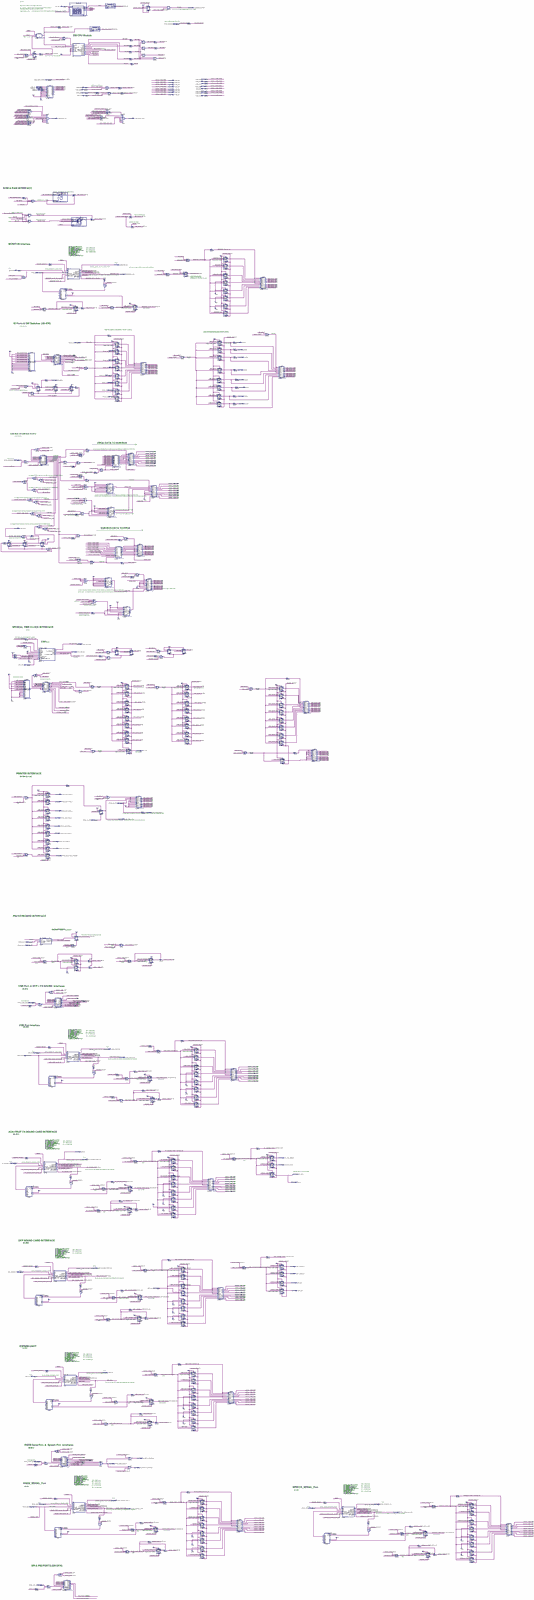
[diagram p0: schematic sheet, whole]
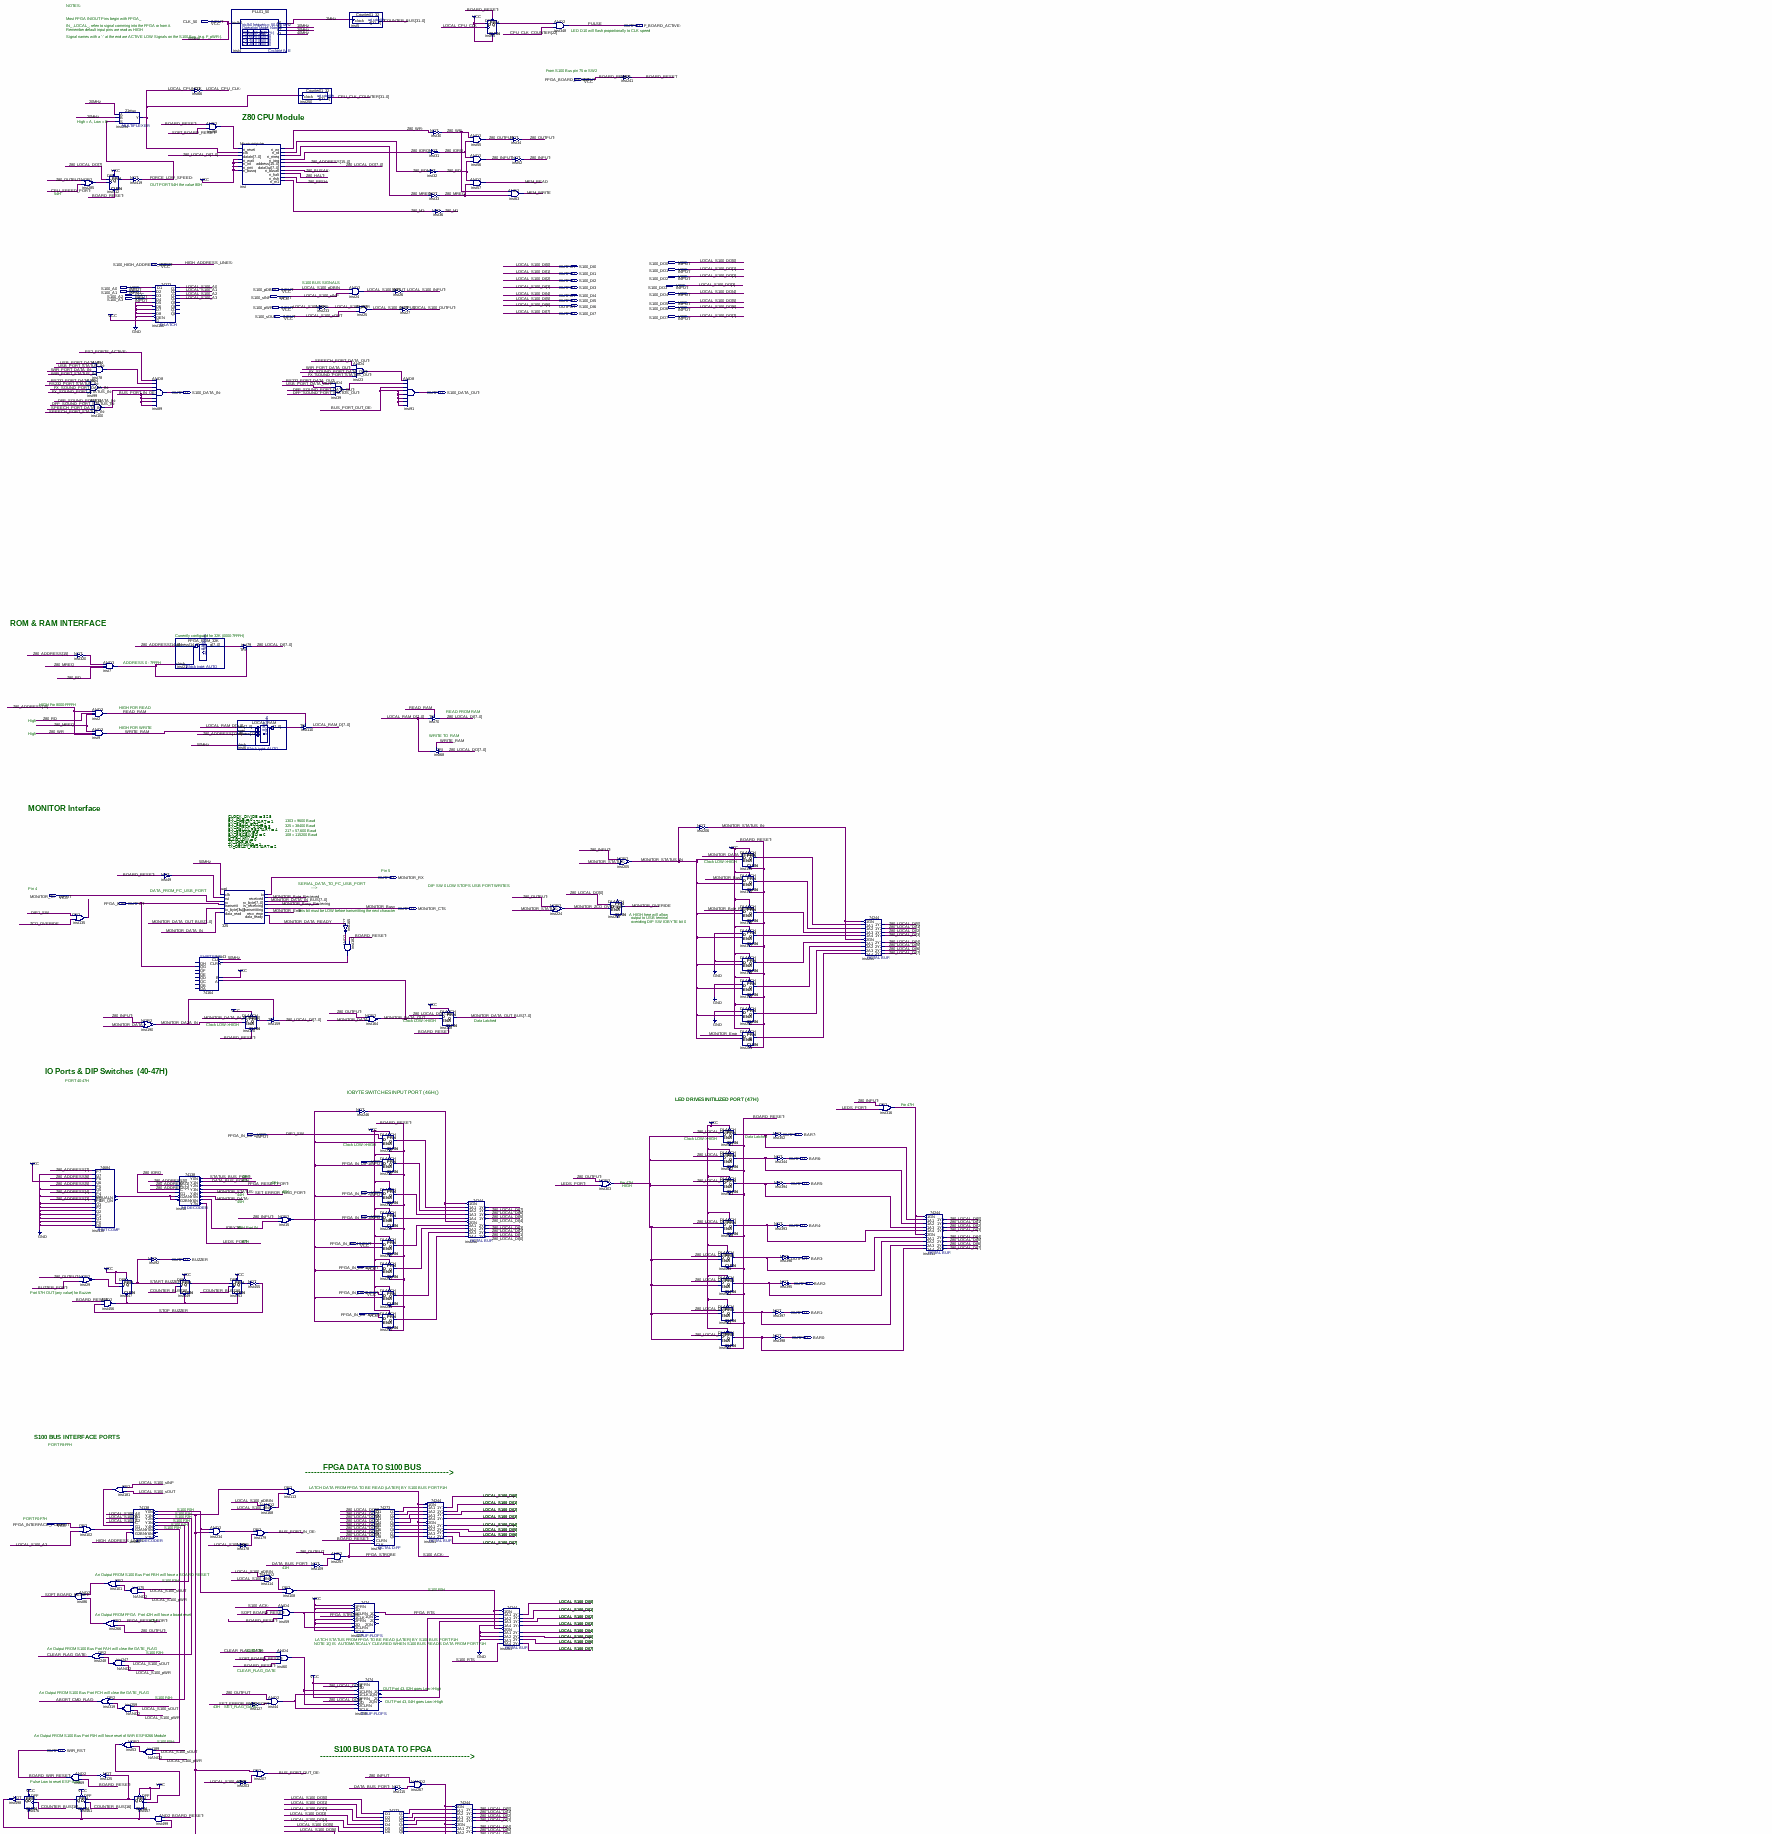
[diagram p1: schematic sheet, upper part]
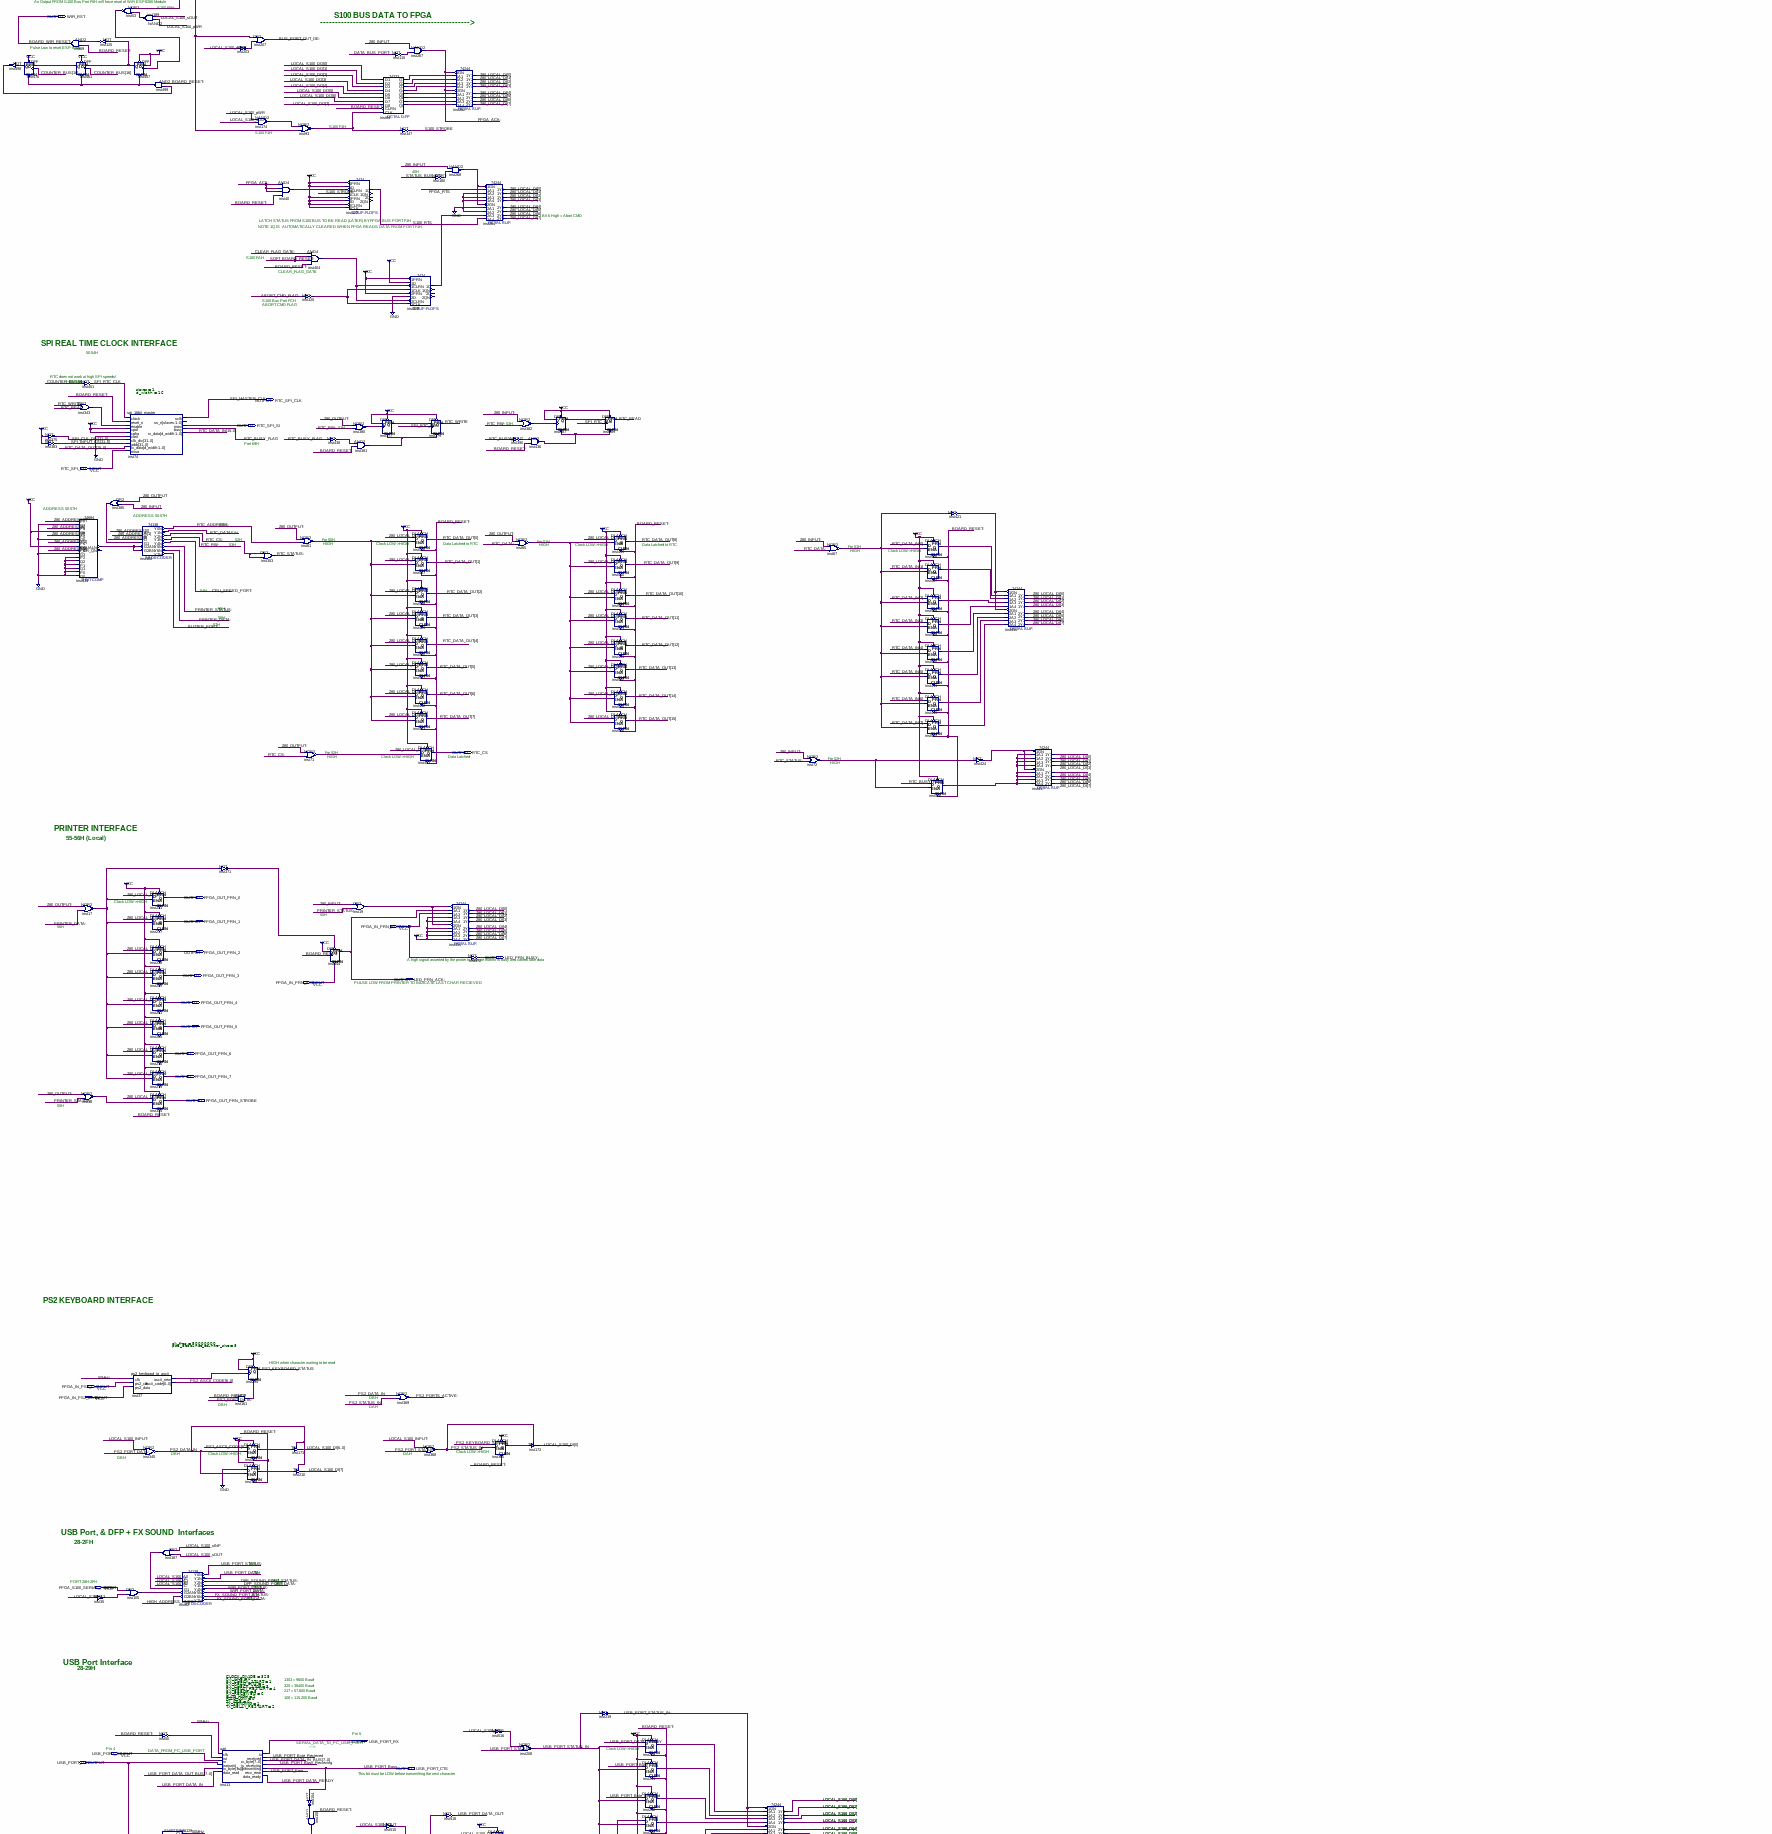
[diagram p2: schematic sheet, middle part]
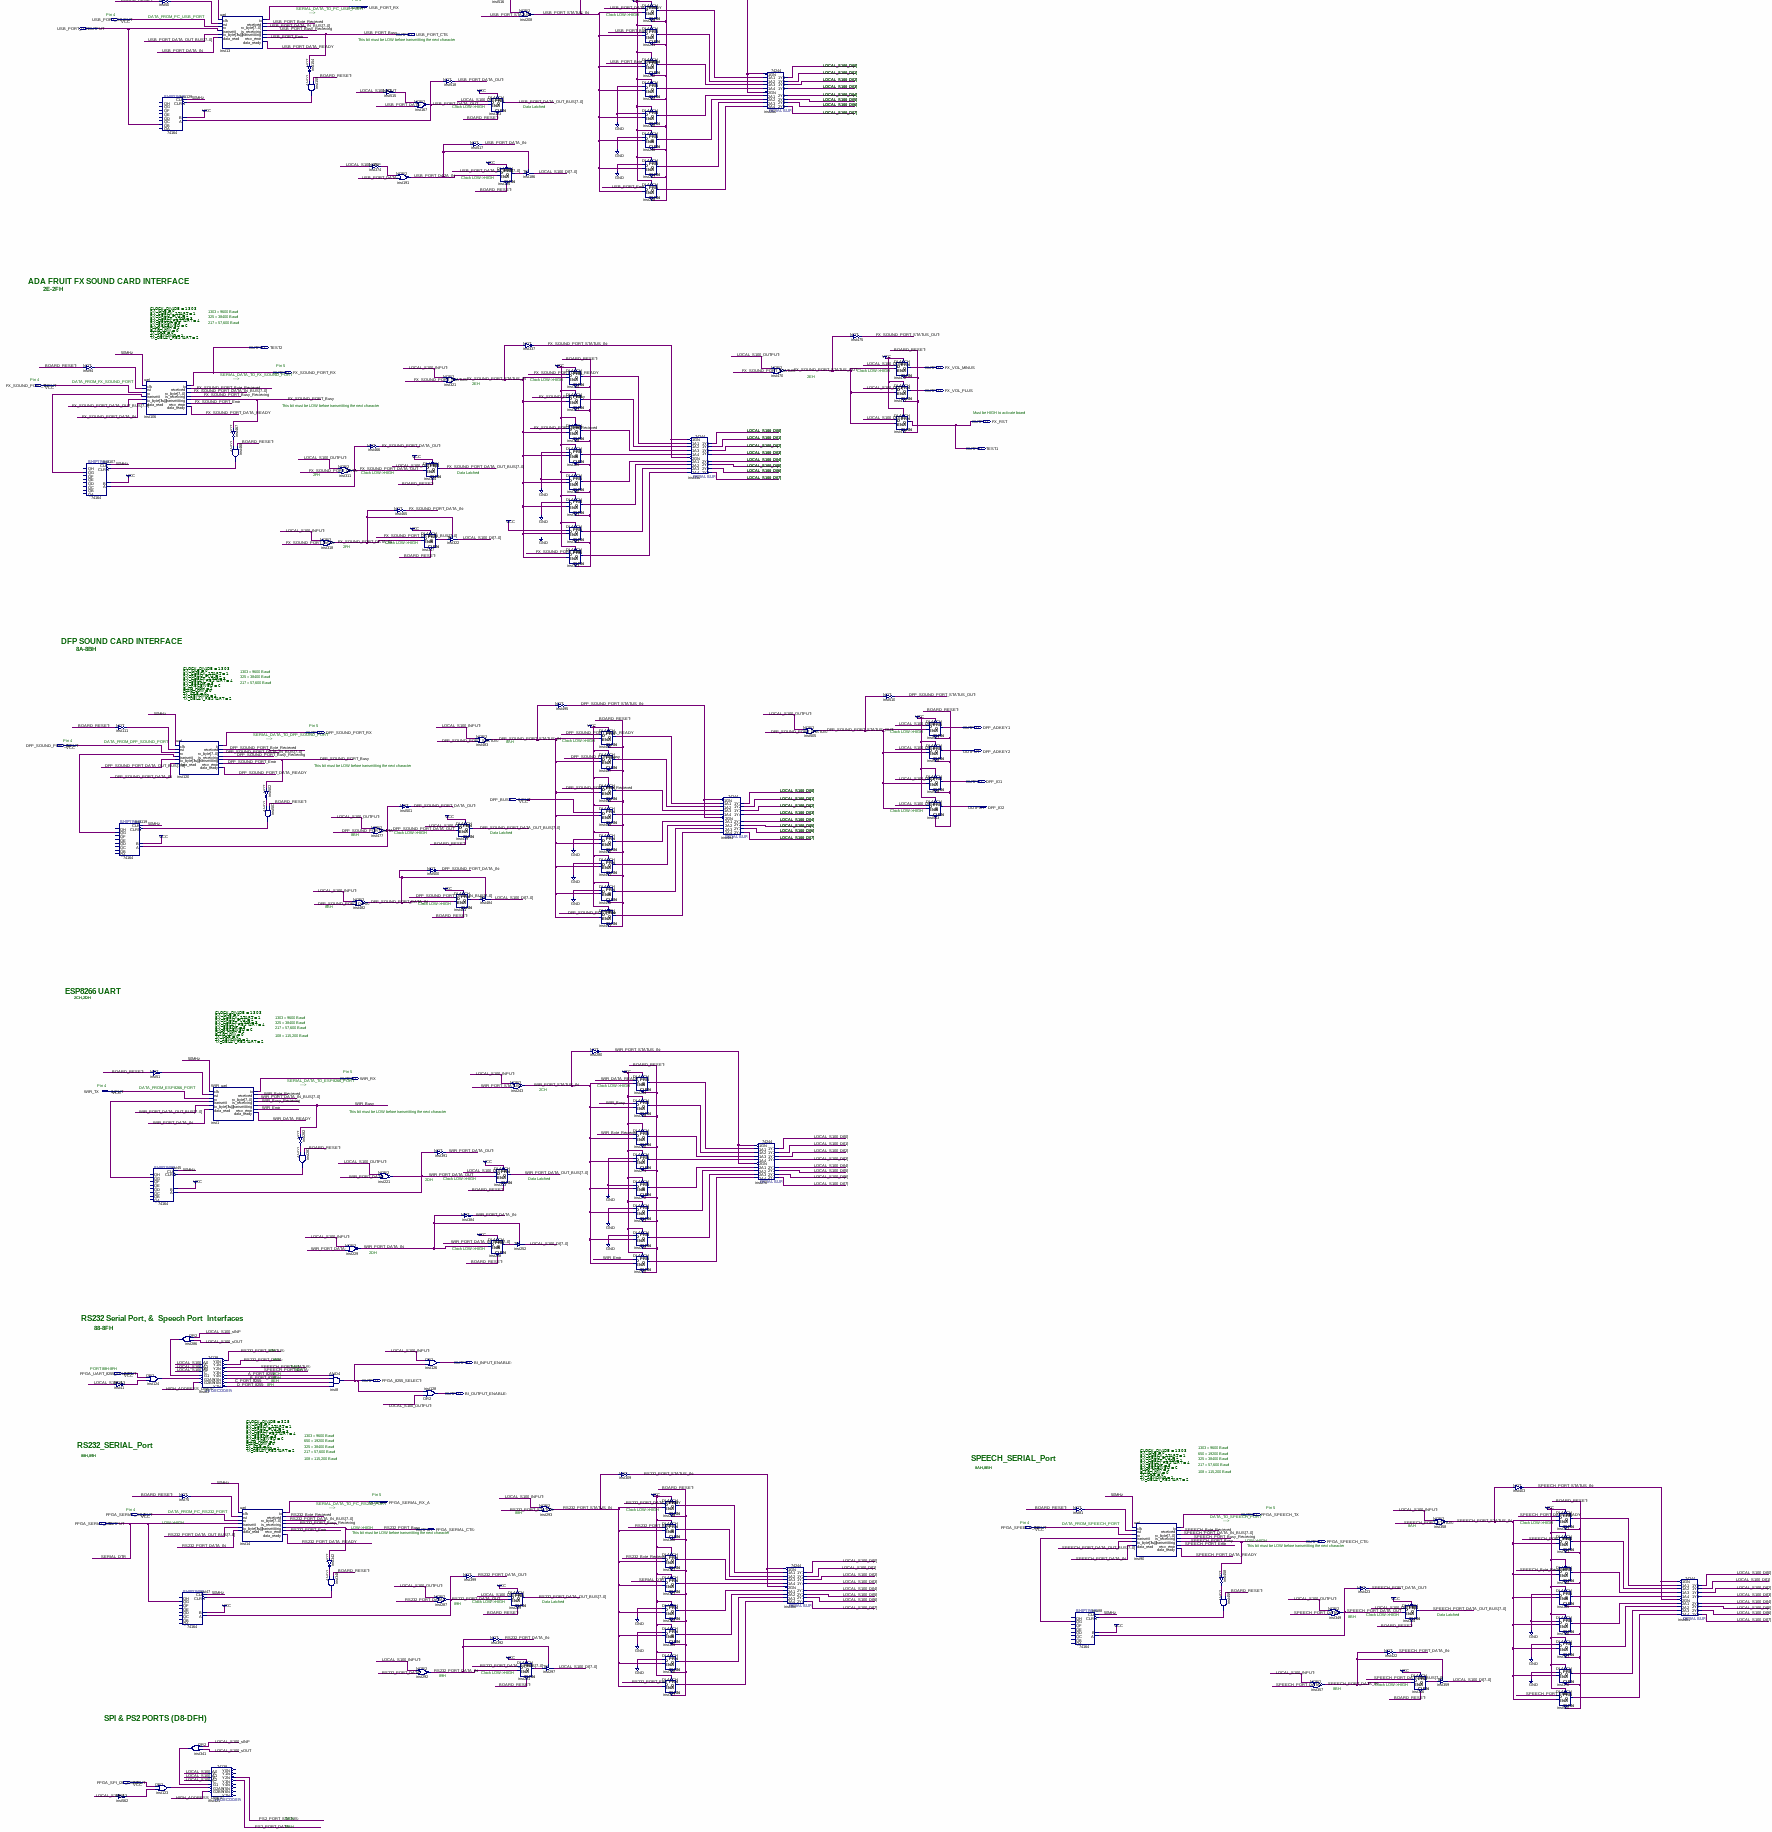
[diagram p3: schematic sheet, lower part]
// Quartus schematic SUPER_IO_BOARD.bdf as structural Verilog: 414 symbols, 105 pins
module SUPER_IO_BOARD (
  input  CLK_50,
  input  \FPGA_BOARD_RESET- ,
  input  S100_DO0,
  input  \S100_HIGH_ADDRESS_LINES- ,
  input  S100_DO1,
  input  S100_DO2,
  input  S100_DO3,
  input  S100_A0,
  input  S100_pDBIN,
  input  S100_A1,
  input  S100_DO4,
  input  S100_A2,
  input  S100_sINP,
  input  S100_A3,
  input  S100_DO5,
  input  \S100_pWR- ,
  input  S100_DO6,
  input  S100_sOUT,
  input  S100_DO7,
  input  MONITOR_TX,
  input  FPGA_IN_DIP0,
  input  FPGA_IN_DIP1,
  input  FPGA_IN_DIP2,
  input  FPGA_IN_DIP3,
  input  FPGA_IN_DIP4,
  input  FPGA_IN_DIP5,
  input  FPGA_IN_DIP6,
  input  FPGA_IN_DIP7,
  input  \FPGA_INTERFACE_PORTS- ,
  input  RTC_SPI_SO,
  input  FPGA_IN_PRN_BUSY,
  input  FPGA_IN_PRN_ACK,
  input  FPGA_IN_PS2_CLK,
  input  FPGA_IN_PS2_DATA,
  input  \FPGA_S100_SERIAL_PORTS- ,
  input  USB_PORT_TX,
  input  FX_SOUND_PORT_TX,
  input  DFP_SOUND_PORT_TX,
  input  DFP_BUSY,
  input  WIFI_TX,
  input  \FPGA_UART_8255_SELECT- ,
  input  FPGA_SERIAL_TX_A,
  input  FPGA_SPEECH_RX,
  input  \FPGA_SPI_I2C_PORTS- ,
  output \F_BOARD_ACTIVE- ,
  output S100_DI0,
  output S100_DI1,
  output S100_DI2,
  output S100_DI3,
  output S100_DI4,
  output S100_DI5,
  output S100_DI6,
  output S100_DI7,
  output \S100_DATA_IN- ,
  output \S100_DATA_OUT- ,
  output MONITOR_RX,
  output FPGA_DTR,
  output MONITOR_CTS,
  output \BAR7- ,
  output \BAR6- ,
  output \BAR5- ,
  output \BAR4- ,
  output \BAR3- ,
  output BUZZER,
  output \BAR2- ,
  output \BAR1- ,
  output \BAR0- ,
  output WIFI_RST,
  output RTC_SPI_CLK,
  output RTC_SPI_SI,
  output RTC_CS,
  output FPGA_OUT_PRN_0,
  output FPGA_OUT_PRN_1,
  output FPGA_OUT_PRN_2,
  output \LED_PRN_BUSY- ,
  output FPGA_OUT_PRN_3,
  output \LED_PRN_ACK- ,
  output FPGA_OUT_PRN_4,
  output FPGA_OUT_PRN_5,
  output FPGA_OUT_PRN_6,
  output FPGA_OUT_PRN_7,
  output FPGA_OUT_PRN_STROBE,
  output USB_PORT_RX,
  output USB_PORT_DTR,
  output USB_PORT_CTS,
  output TEST2,
  output FX_VOL_MINUS,
  output FX_SOUND_PORT_RX,
  output FX_VOL_PLUS,
  output FX_RST,
  output TEST1,
  output DFP_ADKEY1,
  output DFP_SOUND_PORT_RX,
  output DFP_ADKEY2,
  output DFP_IO1,
  output DFP_IO2,
  output WIFI_RX,
  output \BI_INPUT_ENABLE- ,
  output \FPGA_8255_SELECT- ,
  output \BI_OUTPUT_ENABLE- ,
  output FPGA_SERIAL_RX_A,
  output FPGA_SPEECH_TX,
  output \FPGA_SERIAL_DTR- ,
  output \FPGA_SERIAL_CTS- ,
  output \FPGA_SPEECH_CTS- 
);

  wire \2MHz , \10MHz , \20MHz , \40MHz , \A_PORT_8255- , \ABORT_CMD_FLAG- , \B_PORT_8255- , BOARD_RESET,
       \BUS_PORT_IN_OE- , \BUS_PORT_OUT_OE- , \BUZZER_PORT- , \C_PORT_8255- , \CLEAR_FLAG_GATE- ,
       \CPU_SPEED_PORT- , \D_PORT_8255- , \DATA_BUS_PORT- , DFP_SOUND_PORT_Busy,
       DFP_SOUND_PORT_Busy_Recieving, DFP_SOUND_PORT_Byte_Recieved, \DFP_SOUND_PORT_DATA- ,
       DFP_SOUND_PORT_DATA_IN, \DFP_SOUND_PORT_DATA_IN- , DFP_SOUND_PORT_DATA_OUT,
       \DFP_SOUND_PORT_DATA_OUT- , DFP_SOUND_PORT_DATA_READY, DFP_SOUND_PORT_Error, \DFP_SOUND_PORT_STATUS- ,
       DFP_SOUND_PORT_STATUS_IN, \DFP_SOUND_PORT_STATUS_IN- , DFP_SOUND_PORT_STATUS_OUT,
       \DFP_SOUND_PORT_STATUS_OUT- , \FORCE_LOW_SPEED- , \FPGA_ACK- , \FPGA_RESET_PORT- , FPGA_RTS,
       FPGA_STROBE, FX_SOUND_PORT_Busy, FX_SOUND_PORT_Busy_Recieving, FX_SOUND_PORT_Byte_Recieved,
       \FX_SOUND_PORT_DATA- , FX_SOUND_PORT_DATA_IN, \FX_SOUND_PORT_DATA_IN- , FX_SOUND_PORT_DATA_OUT,
       \FX_SOUND_PORT_DATA_OUT- , FX_SOUND_PORT_DATA_READY, FX_SOUND_PORT_Error, \FX_SOUND_PORT_STATUS- ,
       FX_SOUND_PORT_STATUS_IN, \FX_SOUND_PORT_STATUS_IN- , FX_SOUND_PORT_STATUS_OUT,
       \FX_SOUND_PORT_STATUS_OUT- , inst7_out, inst15_out, inst17_out, inst18_out, inst19_out, inst23_out,
       inst29_out, inst35_out, inst37_ascii_new, inst39_out, inst40_out, inst41_out, inst44_out, inst45_qg,
       inst49_out, inst50_out, inst51_out, inst53_out, inst58_out, inst59_out, inst60_out, inst61_out,
       inst65_out, inst67_out, inst71_out, inst72_out, inst75_out, inst76_q1, inst76_q2, inst76_q3,
       inst76_q4, inst76_q5, inst76_q6, inst76_q7, inst76_q8, inst78_out, inst80_y0n, inst80_y1n, inst80_y2n,
       inst80_y3n, inst80_y4n, inst80_y5n, inst81_out, inst84_q1, inst84_q2, inst84_q3, inst84_q4, inst84_q5,
       inst84_q6, inst84_q7, inst84_q8, inst88_qg, inst93_out, inst94_out, inst95_q, inst99_out, inst100_out,
       inst101_out, inst102_out, inst105_out, inst107_qg, inst108_out, inst109_out, inst111_out, inst114_out,
       inst115_out, inst119_qg, inst123_out, inst124_out, inst125_out, inst127_out, inst135_out,
       inst138_equaln, inst154_out, inst155_out, inst161_out, inst165_out, inst168_out, inst174_out,
       inst175_out, inst178_out, inst180_out, inst181_out, inst182_out, inst187_out, inst189_out, inst194_q,
       inst195_q, inst196_q, inst197_q, inst198_q, inst199_q, inst200_q, inst201_q, inst203_out, inst209_q,
       inst211_q, inst212_q, inst214_q, inst215_q, inst216_q, inst217_q, inst218_q, inst225_q, inst226_q,
       inst232_q, inst234_out, inst235_1q, inst235_2q, inst236_q, inst240_q, inst242_q, inst244_q, inst245_q,
       inst246_out, inst247_out, inst254_q, inst259_out, inst266_out, inst268_out, inst269_q, inst270_q,
       inst271_q, inst272_q, inst273_q, inst274_q, inst275_q, inst282_out, inst283_out, inst285_out,
       inst286_out, inst299_q, inst300_q, inst301_q, inst302_q, inst303_out, inst304_q, inst305_q, inst306_q,
       inst307_q, inst316_out, inst320_out, inst324_q, inst325_out, inst326_1q, inst327_q, inst328_q,
       inst329_q, inst330_q, inst331_q, inst332_q, inst333_q, inst339_q, inst341_out, inst342_out,
       inst343_out, inst346_out, inst360_q, inst362_q, inst363_q, inst364_q, inst365_q, inst366_q, inst367_q,
       inst370_q, inst371_out, inst374_out, inst377_q, inst380_out, inst381_out, inst382_out, inst385_out,
       inst387_q, inst390_out, inst400_q, inst404_out, inst406_q, inst407_q, inst408_q, inst409_q, inst410_q,
       inst411_q, inst412_q, inst413_q, inst414_q, inst416_q, inst421_out, inst424_out, inst434_equaln,
       inst436_out, inst438_out, inst449_q, inst453_q, inst456_out, inst457_q, inst458_out, inst459_out,
       inst461_q, inst467_out, inst468_out, inst476_q, inst486_q, inst487_q, inst488_q, inst489_q, inst490_q,
       inst491_q, inst492_q, inst493_q, inst498_out, inst499_out, inst502_out, inst503_out, inst515_out,
       inst516_out, inst531_q, inst532_q, inst533_q, inst539_q, inst541_q, inst542_q, inst543_q, inst544_q,
       inst562_out, \IOBYTE- , \LEDS_PORT- , LOCAL_CPU_CLK, \LOCAL_CPU_CLK- , LOCAL_S100_A0, LOCAL_S100_A1,
       LOCAL_S100_A2, LOCAL_S100_A3, LOCAL_S100_INPUT, \LOCAL_S100_INPUT- , LOCAL_S100_OUTPUT,
       \LOCAL_S100_OUTPUT- , LOCAL_S100_pWR, MEM_READ, MEM_WRITE, MONITOR_Busy_Recieving,
       MONITOR_Byte_Recieved, \MONITOR_DATA- , MONITOR_DATA_IN, MONITOR_DATA_OUT, MONITOR_DATA_READY,
       MONITOR_Error, MONITOR_OVERIDE, \MONITOR_STATUS- , MONITOR_STATUS_IN, \MONITOR_STATUS_IN- ,
       MONITOR_ZCO_OVERIDE, \PRINTER_DATA- , \PRINTER_STATUS- , PS2_DATA_IN, PS2_KEYBOARD_STATUS,
       \PS2_PORT_DATA- , \PS2_PORT_STATUS- , \PS2_PORTS_ACTIVE- , PS2_STATUS_IN, READ_RAM,
       RS232_Byte_Recieved, RS232_PORT_Busy_Recieving, \RS232_PORT_DATA- , RS232_PORT_DATA_IN,
       \RS232_PORT_DATA_IN- , RS232_PORT_DATA_OUT, \RS232_PORT_DATA_OUT- , RS232_PORT_DATA_READY,
       RS232_PORT_Error, \RS232_PORT_STATUS- , RS232_PORT_STATUS_IN, \RS232_PORT_STATUS_IN- , \RTC_ADDRESS- ,
       RTC_BUSY_FLAG, \RTC_CS- , \RTC_DATA- , RTC_READ, \RTC_RW- , \RTC_STATUS- , RTC_WRITE, \S100_ACK- ,
       S100_RTS, S100_STROBE, \SET_ERROR_FLAG_PORT- , \SOFT_BOARD_RESET- , SPEECH_Byte_Recieved,
       SPEECH_PORT_Busy_Recieving, \SPEECH_PORT_DATA- , SPEECH_PORT_DATA_IN, \SPEECH_PORT_DATA_IN- ,
       SPEECH_PORT_DATA_OUT, \SPEECH_PORT_DATA_OUT- , SPEECH_PORT_DATA_READY, SPEECH_PORT_Error,
       \SPEECH_PORT_STATUS- , SPEECH_PORT_STATUS_IN, \SPEECH_PORT_STATUS_IN- , SPI_RTC_CLK, START_BUZZER,
       \STATUS_BUS_PORT- , STOP_BUZZER, USB_PORT_Busy_Recieving, USB_PORT_Byte_Recieved, \USB_PORT_DATA- ,
       USB_PORT_DATA_IN, \USB_PORT_DATA_IN- , USB_PORT_DATA_OUT, \USB_PORT_DATA_OUT- , USB_PORT_DATA_READY,
       USB_PORT_Error, \USB_PORT_STATUS- , USB_PORT_STATUS_IN, \USB_PORT_STATUS_IN- , WIFI_Busy,
       WIFI_Busy_Recieving, WIFI_Byte_Recieved, WIFI_DATA_READY, WIFI_Error, \WIFI_PORT_DATA- ,
       WIFI_PORT_DATA_IN, \WIFI_PORT_DATA_IN- , WIFI_PORT_DATA_OUT, \WIFI_PORT_DATA_OUT- ,
       \WIFI_PORT_STATUS- , WIFI_PORT_STATUS_IN, \WIFI_PORT_STATUS_IN- , WRITE_RAM, \Z80_BUSAK- ,
       \Z80_HALT- , Z80_INPUT, \Z80_INPUT- , Z80_IORQ, \Z80_IORQ- , Z80_M1, \Z80_M1- , Z80_MREQ, \Z80_MREQ- ,
       Z80_OUTPUT, \Z80_OUTPUT- , Z80_RD, \Z80_RD- , \Z80_RFSH- , Z80_WR, \Z80_WR- , ZCO_OVERIDE;
  wire [6:0] inst277_q, PS2_ASCII_CODE;
  wire [7:0] DFP_SOUND_PORT_DATA_IN_BUS, DFP_SOUND_PORT_DATA_OUT_BUS, FX_SOUND_PORT_DATA_IN_BUS,
       FX_SOUND_PORT_DATA_OUT_BUS, inst6_q, inst21_q, inst170_q, inst185_q, inst228_q, inst291_q, inst317_q,
       inst356_q, inst481_q, LOCAL_RAM_D, MONITOR_DATA_IN_BUS, MONITOR_DATA_OUT_BUS, RS232_PORT_DATA_IN_BUS,
       RS232_PORT_DATA_OUT_BUS, SPEECH_PORT_DATA_IN_BUS, SPEECH_PORT_DATA_OUT_BUS, USB_PORT_DATA_IN_BUS,
       USB_PORT_DATA_OUT_BUS, WIFI_PORT_DATA_IN_BUS, WIFI_PORT_DATA_OUT_BUS, Z80_LOCAL_DI, Z80_LOCAL_DO;
  wire [15:0] RTC_DATA_IN, RTC_DATA_OUT, Z80_ADDRESS;
  wire [31:0] COUNTER_BUS, CPU_CLK_COUNTER, SPI_CLK_DIV, SPI_INPUT_CS;

  not inst498 (inst498_out, inst476_q);
  DFF inst476 (.CLRN(inst499_out), .CLK(COUNTER_BUS[16]), .D(inst461_q), .PRN(1'b1), .Q(inst476_q));
  assign SPI_CLK_DIV = ~{32{1'b1}};  // NOT inst375, 32 bits wide
  assign SPI_INPUT_CS = ~{32{1'b1}};  // NOT inst383, 32 bits wide
  not inst320 (inst320_out, Z80_ADDRESS[15]);
  or inst135 (inst135_out, FPGA_IN_DIP0, ZCO_OVERIDE);
  and inst86 (\SOFT_BOARD_RESET- , inst101_out, inst266_out);
  and inst69 (WIFI_RST, inst125_out, \FPGA_BOARD_RESET- );
  DFF inst461 (.CLRN(inst499_out), .CLK(COUNTER_BUS[16]), .D(inst457_q), .PRN(1'b1), .Q(inst461_q));
  \74684  inst434 (
    .P2(1'b0), .Q2(1'b0), .P1(1'b0), .Q1(1'b0), .P0(1'b0), .Q0(1'b0), .P7(Z80_ADDRESS[7]), .Q7(1'b0),
    .Q6(1'b1), .P6(Z80_ADDRESS[6]), .Q5(1'b0), .P5(Z80_ADDRESS[5]), .P4(Z80_ADDRESS[4]), .Q4(1'b1),
    .Q3(1'b0), .P3(Z80_ADDRESS[3]), .EQUALN(inst434_equaln));  // open: P_GR_QN
  nor inst285 (inst285_out, \Z80_OUTPUT- , \CPU_SPEED_PORT- );
  and inst99 (inst99_out, \RS232_PORT_DATA_IN- , \RS232_PORT_STATUS_IN- , \FX_SOUND_PORT_DATA_IN- , \FX_SOUND_PORT_STATUS_IN- );
  and inst100 (inst100_out, \DFP_SOUND_PORT_DATA_IN- , \DFP_SOUND_PORT_STATUS_IN- , \SPEECH_PORT_DATA_IN- , \SPEECH_PORT_STATUS_IN- );
  nor inst29 (inst29_out, \Z80_OUTPUT- , \BUZZER_PORT- );
  or inst102 (inst102_out, \FPGA_INTERFACE_PORTS- , LOCAL_S100_A3);
  or inst248 (\CLEAR_FLAG_GATE- , inst80_y2n, inst247_out);
  not inst451 (SPI_RTC_CLK, COUNTER_BUS[8]);
  or inst343 (inst343_out, RTC_WRITE, RTC_READ);
  nor inst17 (inst17_out, \Z80_OUTPUT- , \PRINTER_DATA- );
  nor inst18 (inst18_out, \Z80_OUTPUT- , \PRINTER_STATUS- );
  not inst94 (inst94_out, \FPGA_BOARD_RESET- );
  \74164  inst107 (
    .CLRN(inst468_out), .CLK(CLK_50), .B(1'b1), .A(FX_SOUND_PORT_DATA_OUT), .QG(inst107_qg));  // open: QD, QC, QA, QF, QH, QE, QB
  and inst78 (inst78_out, \USB_PORT_DATA_IN- , \USB_PORT_STATUS_IN- , \WIFI_PORT_DATA_IN- , \WIFI_PORT_STATUS_IN- );
  and inst7 (inst7_out, inst320_out, Z80_MREQ, Z80_RD);
  and inst2 (READ_RAM, Z80_ADDRESS[15], Z80_RD, Z80_MREQ);
  and inst9 (WRITE_RAM, Z80_MREQ, Z80_WR, Z80_ADDRESS[15]);
  \74684  inst138 (
    .P2(1'b0), .Q2(1'b0), .P1(1'b0), .Q1(1'b0), .P0(1'b0), .Q0(1'b0), .P7(Z80_ADDRESS[7]), .Q7(1'b0),
    .Q6(1'b1), .P6(Z80_ADDRESS[6]), .Q5(1'b0), .P5(Z80_ADDRESS[5]), .P4(Z80_ADDRESS[4]), .Q4(1'b0),
    .Q3(1'b0), .P3(Z80_ADDRESS[3]), .EQUALN(inst138_equaln));  // open: P_GR_QN
  and inst456 (inst456_out, \FPGA_BOARD_RESET- , STOP_BUZZER);
  or inst101 (inst101_out, inst80_y3n, inst175_out);
  or inst266 (inst266_out, \FPGA_RESET_PORT- , \Z80_OUTPUT- );
  or inst319 (\ABORT_CMD_FLAG- , inst80_y4n, inst259_out);
  not inst125 (inst125_out, inst457_q);
  not inst35 (inst35_out, LOCAL_S100_A3);
  \21mux  inst294 (.S(\FORCE_LOW_SPEED- ), .B(\20MHz ), .A(\20MHz ), .Y(LOCAL_CPU_CLK));
  DFF inst412 (.CLRN(\FPGA_BOARD_RESET- ), .CLK(inst285_out), .D(Z80_LOCAL_DO[7]), .PRN(1'b1), .Q(inst412_q));
  DFF inst447 (.CLRN(inst456_out), .CLK(inst29_out), .D(1'b1), .PRN(1'b1), .Q(START_BUZZER));
  or inst181 (inst181_out, S100_sINP, S100_sOUT);
  nand inst247 (inst247_out, LOCAL_S100_pWR, S100_sOUT);
  nand inst259 (inst259_out, LOCAL_S100_pWR, S100_sOUT);
  nor inst53 (inst53_out, inst80_y5n, inst189_out);
  or inst385 (inst385_out, Z80_OUTPUT, Z80_INPUT);
  not inst111 (inst111_out, \FPGA_BOARD_RESET- );
  \74164  inst119 (
    .CLRN(inst503_out), .CLK(CLK_50), .B(1'b1), .A(DFP_SOUND_PORT_DATA_OUT), .QG(inst119_qg));  // open: QD, QC, QA, QF, QH, QE, QB
  not inst41 (inst41_out, LOCAL_S100_A3);
  not inst562 (inst562_out, LOCAL_S100_A3);
  not inst419 (\FORCE_LOW_SPEED- , inst412_q);
  \74138  inst80 (
    .A(LOCAL_S100_A0), .B(LOCAL_S100_A1), .G1(inst181_out), .C(LOCAL_S100_A2), .G2AN(inst102_out),
    .G2BN(\S100_HIGH_ADDRESS_LINES- ), .Y0N(inst80_y0n), .Y1N(inst80_y1n), .Y2N(inst80_y2n),
    .Y3N(inst80_y3n), .Y4N(inst80_y4n), .Y5N(inst80_y5n));  // open: Y6N, Y7N
  nand inst175 (inst175_out, LOCAL_S100_pWR, S100_sOUT);
  DFF inst457 (.CLRN(inst499_out), .CLK(inst53_out), .D(1'b1), .PRN(1'b1), .Q(inst457_q));
  spi_16bit_master #(.slaves(1), .d_width(16)) inst74 (
    .clock(SPI_RTC_CLK), .reset_n(\FPGA_BOARD_RESET- ), .enable(inst343_out), .cpol(1'b1), .cpha(1'b1),
    .cont(1'b0), .clk_div(SPI_CLK_DIV), .addr(SPI_INPUT_CS), .tx_data(RTC_DATA_OUT), .miso(RTC_SPI_SO),
    .sclk(RTC_SPI_CLK), .mosi(RTC_SPI_SI), .busy(RTC_BUSY_FLAG), .rx_data(RTC_DATA_IN));  // open: ss_n
  ps2_keyboard_to_ascii #(.clk_freq(50000000), .ps2_debounce_counter_size(8)) inst37 (
    .clk(CLK_50), .ps2_clk(FPGA_IN_PS2_CLK), .ps2_data(FPGA_IN_PS2_DATA), .ascii_new(inst37_ascii_new),
    .ascii_code(PS2_ASCII_CODE));
  or inst105 (inst105_out, \FPGA_S100_SERIAL_PORTS- , inst35_out);
  nor inst190 (MONITOR_DATA_IN, \Z80_INPUT- , \MONITOR_DATA- );
  not inst92 (BUZZER, START_BUZZER);
  nand inst189 (inst189_out, LOCAL_S100_pWR, S100_sOUT);
  \74138  inst386 (
    .A(Z80_ADDRESS[0]), .B(Z80_ADDRESS[1]), .G1(inst385_out), .C(Z80_ADDRESS[2]), .G2AN(inst434_equaln),
    .G2BN(inst434_equaln), .Y0N(\RTC_ADDRESS- ), .Y1N(\RTC_DATA- ), .Y2N(\RTC_CS- ), .Y3N(\RTC_RW- ),
    .Y4N(\CPU_SPEED_PORT- ), .Y5N(\PRINTER_STATUS- ), .Y6N(\PRINTER_DATA- ), .Y7N(\BUZZER_PORT- ));
  nor inst345 (PS2_DATA_IN, \LOCAL_S100_INPUT- , \PS2_PORT_DATA- );
  uart #(.CLOCK_DIVIDE(1303), .RX_IDLE(0), .RX_CHECK_START(1), .RX_READ_BITS(2), .RX_CHECK_STOP(3), .RX_DELAY_RESTART(4), .RX_ERROR(5), .RX_RECEIVED(6), .FLAG_HIGH(1), .FLAG_LOW(0), .TX_IDLE(0), .TX_SENDING(1), .TX_DELAY_RESTART(2)) inst106 (
    .clk(CLK_50), .rst(inst94_out), .rx(FX_SOUND_PORT_TX), .transmit(inst107_qg),
    .tx_byte(FX_SOUND_PORT_DATA_OUT_BUS), .data_read(FX_SOUND_PORT_DATA_IN), .tx(FX_SOUND_PORT_RX),
    .received(FX_SOUND_PORT_Byte_Recieved), .rx_byte(FX_SOUND_PORT_DATA_IN_BUS),
    .is_receiving(FX_SOUND_PORT_Busy_Recieving), .is_transmitting(FX_SOUND_PORT_Busy),
    .recv_error(FX_SOUND_PORT_Error), .data_ready(FX_SOUND_PORT_DATA_READY));
  or inst124 (inst124_out, \FPGA_UART_8255_SELECT- , inst41_out);
  \74373  inst160 (
    .D1(S100_A0), .D3(S100_A2), .D6(1'b0), .D7(1'b0), .D2(S100_A1), .G(1'b1), .D4(S100_A3), .D5(1'b0),
    .D8(1'b0), .OEN(1'b0), .Q3(LOCAL_S100_A2), .Q2(LOCAL_S100_A1), .Q4(LOCAL_S100_A3), .Q1(LOCAL_S100_A0));  // open: Q6, Q7, Q8, Q5
  and inst89 (\S100_DATA_IN- , \PS2_PORTS_ACTIVE- , inst78_out, inst99_out, inst100_out, \BUS_PORT_IN_OE- , \BUS_PORT_IN_OE- , \BUS_PORT_IN_OE- , \BUS_PORT_IN_OE- );
  not inst49 (inst49_out, \FPGA_BOARD_RESET- );
  and inst499 (inst499_out, \FPGA_BOARD_RESET- , inst498_out);
  DLATCH inst231 (.D(Z80_LOCAL_DO[0]), .ENA(inst17_out), .PRN(1'b1), .Q(FPGA_OUT_PRN_0));  // open: CLRN
  DLATCH inst237 (.D(Z80_LOCAL_DO[1]), .ENA(inst17_out), .PRN(1'b1), .Q(FPGA_OUT_PRN_1));  // open: CLRN
  DLATCH inst238 (.D(Z80_LOCAL_DO[2]), .ENA(inst17_out), .PRN(1'b1), .Q(FPGA_OUT_PRN_2));  // open: CLRN
  DLATCH inst249 (.D(Z80_LOCAL_DO[3]), .ENA(inst17_out), .PRN(1'b1), .Q(FPGA_OUT_PRN_3));  // open: CLRN
  DLATCH inst251 (.D(Z80_LOCAL_DO[4]), .ENA(inst17_out), .PRN(1'b1), .Q(FPGA_OUT_PRN_4));  // open: CLRN
  DLATCH inst265 (.D(Z80_LOCAL_DO[5]), .ENA(inst17_out), .PRN(1'b1), .Q(FPGA_OUT_PRN_5));  // open: CLRN
  DLATCH inst276 (.D(Z80_LOCAL_DO[6]), .ENA(inst17_out), .PRN(1'b1), .Q(FPGA_OUT_PRN_6));  // open: CLRN
  DLATCH inst279 (.D(Z80_LOCAL_DO[7]), .ENA(inst17_out), .PRN(1'b1), .Q(FPGA_OUT_PRN_7));  // open: CLRN
  DLATCH inst334 (
    .CLRN(\FPGA_BOARD_RESET- ), .D(Z80_LOCAL_DO[0]), .ENA(inst18_out), .PRN(1'b1), .Q(FPGA_OUT_PRN_STROBE));
  or inst187 (inst187_out, S100_sINP, S100_sOUT);
  not inst50 (inst50_out, \FPGA_BOARD_RESET- );
  \74164  inst129 (
    .CLRN(inst155_out), .CLK(CLK_50), .B(1'b1), .A(USB_PORT_DATA_OUT), .QB(USB_PORT_DTR));  // open: QD, QC, QA, QF, QH, QG, QE
  not inst51 (inst51_out, \FPGA_BOARD_RESET- );
  \74164  inst45 (
    .CLRN(inst283_out), .CLK(CLK_50), .B(1'b1), .A(WIFI_PORT_DATA_OUT), .QG(inst45_qg));  // open: QD, QC, QA, QF, QH, QE, QB
  or inst123 (inst123_out, \FPGA_SPI_I2C_PORTS- , inst562_out);
  FPGA_ROM_32K inst21 (.address(Z80_ADDRESS[14:0]), .clock(inst7_out), .q(inst21_q));
  \74138  inst16 (
    .A(Z80_ADDRESS[0]), .B(Z80_ADDRESS[1]), .G1(Z80_IORQ), .C(Z80_ADDRESS[2]), .G2AN(inst138_equaln),
    .G2BN(inst138_equaln), .Y0N(\STATUS_BUS_PORT- ), .Y1N(\DATA_BUS_PORT- ), .Y2N(\FPGA_RESET_PORT- ),
    .Y3N(\SET_ERROR_FLAG_PORT- ), .Y4N(\MONITOR_STATUS- ), .Y5N(\MONITOR_DATA- ), .Y6N(\IOBYTE- ),
    .Y7N(\LEDS_PORT- ));
  DFF inst449 (.CLRN(inst456_out), .CLK(COUNTER_BUS[16]), .D(START_BUZZER), .PRN(1'b1), .Q(inst449_q));
  uart #(.CLOCK_DIVIDE(1303), .RX_IDLE(0), .RX_CHECK_START(1), .RX_READ_BITS(2), .RX_CHECK_STOP(3), .RX_DELAY_RESTART(4), .RX_ERROR(5), .RX_RECEIVED(6), .FLAG_HIGH(1), .FLAG_LOW(0), .TX_IDLE(0), .TX_SENDING(1), .TX_DELAY_RESTART(2)) inst120 (
    .clk(CLK_50), .rst(inst111_out), .rx(DFP_SOUND_PORT_TX), .transmit(inst119_qg),
    .tx_byte(DFP_SOUND_PORT_DATA_OUT_BUS), .data_read(DFP_SOUND_PORT_DATA_IN), .tx(DFP_SOUND_PORT_RX),
    .received(DFP_SOUND_PORT_Byte_Recieved), .rx_byte(DFP_SOUND_PORT_DATA_IN_BUS),
    .is_receiving(DFP_SOUND_PORT_Busy_Recieving), .is_transmitting(DFP_SOUND_PORT_Busy),
    .recv_error(DFP_SOUND_PORT_Error), .data_ready(DFP_SOUND_PORT_DATA_READY));
  not inst66 (\LOCAL_CPU_CLK- , LOCAL_CPU_CLK);
  \74138  inst82 (
    .A(LOCAL_S100_A0), .B(LOCAL_S100_A1), .G1(inst187_out), .C(LOCAL_S100_A2), .G2AN(inst105_out),
    .G2BN(\S100_HIGH_ADDRESS_LINES- ), .Y0N(\USB_PORT_STATUS- ), .Y1N(\USB_PORT_DATA- ),
    .Y2N(\DFP_SOUND_PORT_STATUS- ), .Y3N(\DFP_SOUND_PORT_DATA- ), .Y4N(\WIFI_PORT_STATUS- ),
    .Y5N(\WIFI_PORT_DATA- ), .Y6N(\FX_SOUND_PORT_STATUS- ), .Y7N(\FX_SOUND_PORT_DATA- ));
  or inst286 (inst286_out, S100_sINP, S100_sOUT);
  not inst75 (inst75_out, \FPGA_BOARD_RESET- );
  \74164  inst47 (
    .CLRN(inst346_out), .CLK(CLK_50), .B(1'b1), .A(RS232_PORT_DATA_OUT), .QG(\FPGA_SERIAL_DTR- ));  // open: QD, QC, QA, QF, QH, QE, QB
  or inst341 (inst341_out, S100_sINP, S100_sOUT);
  and inst58 (inst58_out, \FPGA_BOARD_RESET- , \SOFT_BOARD_RESET- );
  \74164  inst43 (
    .CLRN(inst182_out), .CLK(CLK_50), .B(1'b1), .A(MONITOR_DATA_OUT), .QG(FPGA_DTR));  // open: QD, QC, QA, QF, QH, QE, QB
  \74138  inst83 (
    .A(LOCAL_S100_A0), .B(LOCAL_S100_A1), .G1(inst286_out), .C(LOCAL_S100_A2), .G2AN(inst124_out),
    .G2BN(\S100_HIGH_ADDRESS_LINES- ), .Y0N(\RS232_PORT_STATUS- ), .Y1N(\RS232_PORT_DATA- ),
    .Y2N(\SPEECH_PORT_STATUS- ), .Y3N(\SPEECH_PORT_DATA- ), .Y4N(\A_PORT_8255- ), .Y5N(\B_PORT_8255- ),
    .Y6N(\C_PORT_8255- ), .Y7N(\D_PORT_8255- ));
  uart #(.CLOCK_DIVIDE(325), .RX_IDLE(0), .RX_CHECK_START(1), .RX_READ_BITS(2), .RX_CHECK_STOP(3), .RX_DELAY_RESTART(4), .RX_ERROR(5), .RX_RECEIVED(6), .FLAG_HIGH(1), .FLAG_LOW(0), .TX_IDLE(0), .TX_SENDING(1), .TX_DELAY_RESTART(2)) u_325 (
    .clk(CLK_50), .rst(inst49_out), .rx(MONITOR_TX), .transmit(FPGA_DTR), .tx_byte(MONITOR_DATA_OUT_BUS),
    .data_read(MONITOR_DATA_IN), .tx(MONITOR_RX), .received(MONITOR_Byte_Recieved),
    .rx_byte(MONITOR_DATA_IN_BUS), .is_receiving(MONITOR_Busy_Recieving), .is_transmitting(MONITOR_CTS),
    .recv_error(MONITOR_Error), .data_ready(MONITOR_DATA_READY));
  and inst234 (inst234_out, inst80_y0n, inst80_y1n);
  not inst371 (inst371_out, inst17_out);
  uart #(.CLOCK_DIVIDE(325), .RX_IDLE(0), .RX_CHECK_START(1), .RX_READ_BITS(2), .RX_CHECK_STOP(3), .RX_DELAY_RESTART(4), .RX_ERROR(5), .RX_RECEIVED(6), .FLAG_HIGH(1), .FLAG_LOW(0), .TX_IDLE(0), .TX_SENDING(1), .TX_DELAY_RESTART(2)) inst13 (
    .clk(CLK_50), .rst(inst50_out), .rx(USB_PORT_TX), .transmit(USB_PORT_DTR),
    .tx_byte(USB_PORT_DATA_OUT_BUS), .data_read(USB_PORT_DATA_IN), .tx(USB_PORT_RX),
    .received(USB_PORT_Byte_Recieved), .rx_byte(USB_PORT_DATA_IN_BUS),
    .is_receiving(USB_PORT_Busy_Recieving), .is_transmitting(USB_PORT_CTS), .recv_error(USB_PORT_Error),
    .data_ready(USB_PORT_DATA_READY));
  WIFI_uart #(.CLOCK_DIVIDE(1303), .RX_IDLE(0), .RX_CHECK_START(1), .RX_READ_BITS(2), .RX_CHECK_STOP(3), .RX_DELAY_RESTART(4), .RX_ERROR(5), .RX_RECEIVED(6), .FLAG_HIGH(1), .FLAG_LOW(0), .TX_IDLE(0), .TX_SENDING(1), .TX_DELAY_RESTART(2)) inst1 (
    .clk(CLK_50), .rst(inst51_out), .rx(WIFI_TX), .transmit(inst45_qg), .tx_byte(WIFI_PORT_DATA_OUT_BUS),
    .data_read(WIFI_PORT_DATA_IN), .tx(WIFI_RX), .received(WIFI_Byte_Recieved),
    .rx_byte(WIFI_PORT_DATA_IN_BUS), .is_receiving(WIFI_Busy_Recieving), .is_transmitting(WIFI_Busy),
    .recv_error(WIFI_Error), .data_ready(WIFI_DATA_READY));
  \74138  inst121 (
    .A(LOCAL_S100_A0), .B(LOCAL_S100_A1), .G1(inst341_out), .C(LOCAL_S100_A2), .G2AN(inst123_out),
    .G2BN(\S100_HIGH_ADDRESS_LINES- ), .Y2N(\PS2_PORT_STATUS- ), .Y3N(\PS2_PORT_DATA- ));  // open: Y0N, Y1N, Y4N, Y5N, Y6N, Y7N
  PLL01_50 inst4 (.inclk0(CLK_50), .c0(\2MHz ), .c1(\10MHz ), .c2(\20MHz ), .c3(\40MHz ));
  DFF inst453 (.CLRN(inst456_out), .CLK(COUNTER_BUS[16]), .D(inst449_q), .PRN(1'b1), .Q(inst453_q));
  and inst161 (inst161_out, \FPGA_BOARD_RESET- , \PS2_PORT_DATA- );
  not inst467 (inst467_out, FX_SOUND_PORT_Busy);
  and inst468 (inst468_out, inst467_out, \FPGA_BOARD_RESET- );
  Microcomputer inst (
    .n_reset(inst58_out), .clk(LOCAL_CPU_CLK), .dataIn(Z80_LOCAL_DI), .n_wait(1'b1), .n_int(1'b1),
    .n_nmi(1'b1), .n_busrq(1'b1), .n_wr(\Z80_WR- ), .n_rd(\Z80_RD- ), .n_mreq(\Z80_MREQ- ),
    .n_iorq(\Z80_IORQ- ), .address(Z80_ADDRESS), .dataOut(Z80_LOCAL_DO), .n_busak(\Z80_BUSAK- ),
    .n_halt(\Z80_HALT- ), .n_rfsh(\Z80_RFSH- ), .n_m1(\Z80_M1- ));
  TRI inst79[7:0] (.IN(inst21_q), .OE(inst7_out), .OUT(Z80_LOCAL_DI));
  LOCAL_RAM inst6 (.data(LOCAL_RAM_D), .wren(WRITE_RAM), .address(Z80_ADDRESS[12:0]), .clock(CLK_50), .q(inst6_q));
  DLATCH inst170[7:0] (
    .CLRN(\FPGA_BOARD_RESET- ), .D(MONITOR_DATA_IN_BUS), .ENA(MONITOR_DATA_IN), .PRN(1'b1), .Q(inst170_q));
  not inst455 (STOP_BUZZER, inst453_q);
  not inst178 (inst178_out, S100_sINP);
  not inst127 (inst127_out, \SET_ERROR_FLAG_PORT- );
  not inst203 (inst203_out, S100_sOUT);
  DFF inst295 (.CLRN(inst161_out), .CLK(inst37_ascii_new), .D(1'b1), .PRN(1'b1), .Q(PS2_KEYBOARD_STATUS));
  DLATCH inst277[6:0] (.CLRN(\FPGA_BOARD_RESET- ), .D(PS2_ASCII_CODE), .ENA(PS2_DATA_IN), .PRN(1'b1), .Q(inst277_q));
  DLATCH inst339 (.CLRN(\FPGA_BOARD_RESET- ), .D(1'b0), .ENA(PS2_DATA_IN), .PRN(1'b1), .Q(inst339_q));
  uart #(.CLOCK_DIVIDE(325), .RX_IDLE(0), .RX_CHECK_START(1), .RX_READ_BITS(2), .RX_CHECK_STOP(3), .RX_DELAY_RESTART(4), .RX_ERROR(5), .RX_RECEIVED(6), .FLAG_HIGH(1), .FLAG_LOW(0), .TX_IDLE(0), .TX_SENDING(1), .TX_DELAY_RESTART(2)) inst14 (
    .clk(CLK_50), .rst(inst75_out), .rx(FPGA_SERIAL_TX_A), .transmit(\FPGA_SERIAL_DTR- ),
    .tx_byte(RS232_PORT_DATA_OUT_BUS), .data_read(RS232_PORT_DATA_IN), .tx(FPGA_SERIAL_RX_A),
    .received(RS232_Byte_Recieved), .rx_byte(RS232_PORT_DATA_IN_BUS),
    .is_receiving(RS232_PORT_Busy_Recieving), .is_transmitting(\FPGA_SERIAL_CTS- ),
    .recv_error(RS232_PORT_Error), .data_ready(RS232_PORT_DATA_READY));
  nand inst168 (inst168_out, S100_pDBIN, S100_sINP);
  or inst179 (\BUS_PORT_IN_OE- , inst234_out, inst178_out);
  nand inst114 (inst114_out, S100_pDBIN, S100_sINP);
  or inst207 (\BUS_PORT_OUT_OE- , inst80_y1n, inst203_out);
  nand inst174 (inst174_out, LOCAL_S100_pWR, S100_sOUT);
  or inst353 (\RTC_STATUS- , \RTC_CS- , \RTC_CS- );
  not inst502 (inst502_out, DFP_SOUND_PORT_Busy);
  and inst503 (inst503_out, inst502_out, \FPGA_BOARD_RESET- );
  TRI inst159[7:0] (.IN(inst170_q), .OE(MONITOR_DATA_IN), .OUT(Z80_LOCAL_DI));
  nor inst15 (inst15_out, \Z80_INPUT- , \IOBYTE- );
  and inst59 (inst59_out, \S100_ACK- , \SOFT_BOARD_RESET- , \SOFT_BOARD_RESET- , \FPGA_BOARD_RESET- );
  and inst60 (inst60_out, \CLEAR_FLAG_GATE- , \SOFT_BOARD_RESET- , \SOFT_BOARD_RESET- , \FPGA_BOARD_RESET- );
  and inst44 (inst44_out, Z80_OUTPUT, inst127_out);
  and inst40 (inst40_out, \FPGA_ACK- , \FPGA_ACK- , \FPGA_ACK- , \FPGA_BOARD_RESET- );
  or inst113 (\S100_ACK- , inst80_y1n, inst168_out);
  or inst108 (inst108_out, inst114_out, inst80_y0n);
  TRI inst173[6:0] (
    .IN(inst277_q), .OE(PS2_DATA_IN),
    .OUT({S100_DI6, S100_DI5, S100_DI4, S100_DI3, S100_DI2, S100_DI1, S100_DI0}));
  TRI inst210 (.IN(inst339_q), .OE(PS2_DATA_IN), .OUT(S100_DI7));
  Counter01_32 inst250 (.clock(LOCAL_CPU_CLK), .q(CPU_CLK_COUNTER));
  TRI inst110[7:0] (.IN(inst6_q), .OE(READ_RAM), .OUT(LOCAL_RAM_D));
  nor inst93 (inst93_out, inst174_out, inst80_y1n);
  and inst404 (inst404_out, \CLEAR_FLAG_GATE- , \SOFT_BOARD_RESET- , \SOFT_BOARD_RESET- , \FPGA_BOARD_RESET- );
  not inst325 (inst325_out, \ABORT_CMD_FLAG- );
  nor inst61 (inst61_out, \Z80_OUTPUT- , \RTC_ADDRESS- );
  nor inst71 (inst71_out, \Z80_OUTPUT- , \RTC_CS- );
  not inst154 (inst154_out, USB_PORT_CTS);
  and inst155 (inst155_out, inst154_out, \FPGA_BOARD_RESET- );
  not inst282 (inst282_out, WIFI_Busy);
  and inst283 (inst283_out, inst282_out, \FPGA_BOARD_RESET- );
  not inst233 (LOCAL_S100_pWR, \S100_pWR- );
  not inst109 (inst109_out, \DATA_BUS_PORT- );
  nor inst318 (FX_SOUND_PORT_DATA_IN, \LOCAL_S100_INPUT- , \FX_SOUND_PORT_DATA- );
  and inst39 (inst39_out, \RS232_PORT_DATA_OUT- , \USB_PORT_DATA_OUT- , \DFP_SOUND_PORT_DATA_OUT- , \DFP_SOUND_PORT_STATUS_OUT- );
  and inst257 (FPGA_STROBE, Z80_OUTPUT, inst109_out);
  not inst438 (inst438_out, RTC_BUSY_FLAG);
  DFF inst144 (.CLRN(FPGA_IN_PRN_ACK), .CLK(\FPGA_BOARD_RESET- ), .D(1'b1), .PRN(inst371_out), .Q(\LED_PRN_ACK- ));
  and inst8 (\FPGA_8255_SELECT- , \A_PORT_8255- , \B_PORT_8255- , \C_PORT_8255- , \D_PORT_8255- );
  not inst342 (inst342_out, \FPGA_SERIAL_CTS- );
  and inst346 (inst346_out, inst342_out, \FPGA_BOARD_RESET- );
  Counter01_32 inst5 (.clock(\2MHz ), .q(COUNTER_BUS));
  and inst24 (LOCAL_S100_INPUT, S100_pDBIN, S100_sINP);
  not inst165 (inst165_out, MONITOR_DATA_READY);
  and inst182 (inst182_out, inst165_out, \FPGA_BOARD_RESET- );
  \7474  inst117 (
    .\2D (1'b1), .\2PRN (1'b1), .\1CLK (FPGA_STROBE), .\1D (1'b1), .\1PRN (1'b1), .\2CLK (1'b1),
    .\2CLRN (inst59_out), .\1CLRN (inst59_out), .\1Q (FPGA_RTS));  // open: 1QN, 2Q, 2QN
  \7474  inst122 (
    .\2D (1'b1), .\2PRN (1'b1), .\1CLK (S100_STROBE), .\1D (1'b1), .\1PRN (1'b1), .\2CLK (1'b1),
    .\2CLRN (1'b1), .\1CLRN (inst40_out), .\1Q (S100_RTS));  // open: 1QN, 2Q, 2QN
  nor inst311 (FX_SOUND_PORT_DATA_OUT, \LOCAL_S100_OUTPUT- , \FX_SOUND_PORT_DATA- );
  nor inst229 (WIFI_PORT_DATA_IN, \LOCAL_S100_INPUT- , \WIFI_PORT_DATA- );
  and inst25 (LOCAL_S100_OUTPUT, LOCAL_S100_pWR, S100_sOUT);
  and inst23 (inst23_out, \SPEECH_PORT_DATA_OUT- , \WIFI_PORT_DATA_OUT- , \FX_SOUND_PORT_DATA_OUT- , \FX_SOUND_PORT_STATUS_OUT- );
  nor inst164 (MONITOR_DATA_OUT, \Z80_OUTPUT- , \MONITOR_DATA- );
  not inst246 (inst246_out, inst15_out);
  \7474  inst235 (
    .\2D (Z80_LOCAL_DO[2]), .\2PRN (1'b1), .\1CLK (inst44_out), .\1D (Z80_LOCAL_DO[1]), .\1PRN (1'b1),
    .\2CLK (inst44_out), .\2CLRN (inst60_out), .\1CLRN (inst60_out), .\2Q (inst235_2q), .\1Q (inst235_1q));  // open: 1QN, 2QN
  nor inst380 (inst380_out, \Z80_OUTPUT- , \RTC_RW- );
  and inst381 (inst381_out, inst438_out, \FPGA_BOARD_RESET- );
  or inst19 (inst19_out, \Z80_INPUT- , \PRINTER_STATUS- );
  nor inst482 (DFP_SOUND_PORT_DATA_IN, \LOCAL_S100_INPUT- , \DFP_SOUND_PORT_DATA- );
  DLATCH inst225 (.CLRN(\FPGA_BOARD_RESET- ), .D(FPGA_IN_DIP0), .ENA(inst15_out), .PRN(1'b1), .Q(inst225_q));
  DLATCH inst226 (.CLRN(\FPGA_BOARD_RESET- ), .D(FPGA_IN_DIP1), .ENA(inst15_out), .PRN(1'b1), .Q(inst226_q));
  DLATCH inst232 (.CLRN(\FPGA_BOARD_RESET- ), .D(FPGA_IN_DIP2), .ENA(inst15_out), .PRN(1'b1), .Q(inst232_q));
  DLATCH inst236 (.CLRN(\FPGA_BOARD_RESET- ), .D(FPGA_IN_DIP3), .ENA(inst15_out), .PRN(1'b1), .Q(inst236_q));
  DLATCH inst240 (.CLRN(\FPGA_BOARD_RESET- ), .D(FPGA_IN_DIP4), .ENA(inst15_out), .PRN(1'b1), .Q(inst240_q));
  DLATCH inst242 (.CLRN(\FPGA_BOARD_RESET- ), .D(FPGA_IN_DIP5), .ENA(inst15_out), .PRN(1'b1), .Q(inst242_q));
  DLATCH inst244 (.CLRN(\FPGA_BOARD_RESET- ), .D(FPGA_IN_DIP6), .ENA(inst15_out), .PRN(1'b1), .Q(inst244_q));
  DLATCH inst245 (.CLRN(\FPGA_BOARD_RESET- ), .D(FPGA_IN_DIP7), .ENA(inst15_out), .PRN(1'b1), .Q(inst245_q));
  \74273  inst76 (
    .D2(Z80_LOCAL_DO[1]), .D3(Z80_LOCAL_DO[2]), .D1(Z80_LOCAL_DO[0]), .D4(Z80_LOCAL_DO[3]),
    .D7(Z80_LOCAL_DO[6]), .D6(Z80_LOCAL_DO[5]), .D5(Z80_LOCAL_DO[4]), .D8(Z80_LOCAL_DO[7]),
    .CLK(FPGA_STROBE), .CLRN(\FPGA_BOARD_RESET- ), .Q4(inst76_q4), .Q1(inst76_q1), .Q2(inst76_q2),
    .Q3(inst76_q3), .Q6(inst76_q6), .Q5(inst76_q5), .Q7(inst76_q7), .Q8(inst76_q8));
  \74273  inst84 (
    .D2(S100_DO1), .D3(S100_DO2), .D1(S100_DO0), .D4(S100_DO3), .D7(S100_DO6), .D6(S100_DO5), .D5(S100_DO4),
    .D8(S100_DO7), .CLK(inst93_out), .CLRN(\FPGA_BOARD_RESET- ), .Q4(inst84_q4), .Q1(inst84_q1),
    .Q2(inst84_q2), .Q3(inst84_q3), .Q6(inst84_q6), .Q5(inst84_q5), .Q7(inst84_q7), .Q8(inst84_q8));
  DFF inst377 (.CLRN(inst381_out), .CLK(inst380_out), .D(1'b1), .PRN(1'b1), .Q(inst377_q));
  not inst374 (inst374_out, S100_sINP);
  not inst466 (\FX_SOUND_PORT_DATA_OUT- , FX_SOUND_PORT_DATA_OUT);
  nor inst477 (DFP_SOUND_PORT_DATA_OUT, \LOCAL_S100_OUTPUT- , \DFP_SOUND_PORT_DATA- );
  nor inst221 (WIFI_PORT_DATA_OUT, \LOCAL_S100_OUTPUT- , \WIFI_PORT_DATA- );
  not inst26 (\LOCAL_S100_INPUT- , LOCAL_S100_INPUT);
  not inst115 (inst115_out, \DATA_BUS_PORT- );
  not inst515 (inst515_out, S100_sOUT);
  not inst465 (\FX_SOUND_PORT_DATA_IN- , FX_SOUND_PORT_DATA_IN);
  not inst27 (\LOCAL_S100_OUTPUT- , LOCAL_S100_OUTPUT);
  and inst91 (\S100_DATA_OUT- , inst23_out, inst39_out, \BUS_PORT_OUT_OE- , \BUS_PORT_OUT_OE- , \BUS_PORT_OUT_OE- , \BUS_PORT_OUT_OE- , \BUS_PORT_OUT_OE- , \BUS_PORT_OUT_OE- );
  not inst147 (S100_STROBE, inst93_out);
  \7474  inst326 (
    .\2D (1'b0), .\2PRN (1'b1), .\1CLK (inst325_out), .\1D (1'b1), .\1PRN (1'b1), .\2CLK (inst325_out),
    .\2CLRN (inst404_out), .\1CLRN (inst404_out), .\1Q (inst326_1q));  // open: 1QN, 2Q, 2QN
  nor inst369 (\PS2_PORTS_ACTIVE- , PS2_DATA_IN, PS2_STATUS_IN);
  nor inst191 (USB_PORT_DATA_IN, inst374_out, \USB_PORT_DATA- );
  not inst501 (\DFP_SOUND_PORT_DATA_OUT- , DFP_SOUND_PORT_DATA_OUT);
  \74244  inst261 (
    .\1A2 (inst76_q2), .\1A4 (inst76_q4), .\1A1 (inst76_q1), .\1A3 (inst76_q3), .\1GN (\S100_ACK- ),
    .\2A3 (inst76_q7), .\2GN (\S100_ACK- ), .\2A1 (inst76_q5), .\2A4 (inst76_q8), .\2A2 (inst76_q6),
    .\1Y2 (S100_DI1), .\1Y4 (S100_DI3), .\2Y1 (S100_DI4), .\1Y1 (S100_DI0), .\2Y3 (S100_DI6),
    .\2Y4 (S100_DI7), .\1Y3 (S100_DI2), .\2Y2 (S100_DI5));
  nand inst267 (\FPGA_ACK- , Z80_INPUT, inst115_out);
  DLATCH inst426 (.CLRN(\FPGA_BOARD_RESET- ), .D(Z80_LOCAL_DO[0]), .ENA(inst61_out), .PRN(1'b1), .Q(RTC_DATA_OUT[0]));
  DLATCH inst427 (.CLRN(\FPGA_BOARD_RESET- ), .D(Z80_LOCAL_DO[1]), .ENA(inst61_out), .PRN(1'b1), .Q(RTC_DATA_OUT[1]));
  DLATCH inst428 (.CLRN(\FPGA_BOARD_RESET- ), .D(Z80_LOCAL_DO[2]), .ENA(inst61_out), .PRN(1'b1), .Q(RTC_DATA_OUT[2]));
  DLATCH inst429 (.CLRN(\FPGA_BOARD_RESET- ), .D(Z80_LOCAL_DO[3]), .ENA(inst61_out), .PRN(1'b1), .Q(RTC_DATA_OUT[3]));
  DLATCH inst430 (.CLRN(\FPGA_BOARD_RESET- ), .D(Z80_LOCAL_DO[4]), .ENA(inst61_out), .PRN(1'b1), .Q(RTC_DATA_OUT[4]));
  DLATCH inst431 (.CLRN(\FPGA_BOARD_RESET- ), .D(Z80_LOCAL_DO[5]), .ENA(inst61_out), .PRN(1'b1), .Q(RTC_DATA_OUT[5]));
  DLATCH inst432 (.CLRN(\FPGA_BOARD_RESET- ), .D(Z80_LOCAL_DO[6]), .ENA(inst61_out), .PRN(1'b1), .Q(RTC_DATA_OUT[6]));
  DLATCH inst433 (.CLRN(\FPGA_BOARD_RESET- ), .D(Z80_LOCAL_DO[7]), .ENA(inst61_out), .PRN(1'b1), .Q(RTC_DATA_OUT[7]));
  DLATCH inst402 (.CLRN(\FPGA_BOARD_RESET- ), .D(Z80_LOCAL_DO[0]), .ENA(inst71_out), .PRN(1'b1), .Q(RTC_CS));
  nor inst368 (PS2_STATUS_IN, \LOCAL_S100_INPUT- , \PS2_PORT_STATUS- );
  nor inst167 (USB_PORT_DATA_OUT, inst515_out, \USB_PORT_DATA- );
  DLATCH inst314[7:0] (
    .CLRN(\FPGA_BOARD_RESET- ),
    .D({S100_DO7, S100_DO6, S100_DO5, S100_DO4, S100_DO3, S100_DO2, S100_DO1, S100_DO0}),
    .ENA(FX_SOUND_PORT_DATA_OUT), .PRN(1'b1), .Q(FX_SOUND_PORT_DATA_OUT_BUS));
  DLATCH inst317[7:0] (
    .CLRN(\FPGA_BOARD_RESET- ), .D(FX_SOUND_PORT_DATA_IN_BUS), .ENA(FX_SOUND_PORT_DATA_IN), .PRN(1'b1),
    .Q(inst317_q));
  or inst128 (\BI_OUTPUT_ENABLE- , \LOCAL_S100_OUTPUT- , \FPGA_8255_SELECT- );
  nor inst292 (RS232_PORT_DATA_IN, \LOCAL_S100_INPUT- , \RS232_PORT_DATA- );
  not inst30 (Z80_WR, \Z80_WR- );
  not inst31 (Z80_IORQ, \Z80_IORQ- );
  not inst32 (Z80_RD, \Z80_RD- );
  not inst33 (Z80_MREQ, \Z80_MREQ- );
  not inst36 (Z80_M1, \Z80_M1- );
  TRI inst70[7:0] (.IN(LOCAL_RAM_D), .OE(READ_RAM), .OUT(Z80_LOCAL_DI));
  TRI inst68[7:0] (.IN(Z80_LOCAL_DO), .OE(WRITE_RAM), .OUT(LOCAL_RAM_D));
  not inst180 (inst180_out, \STATUS_BUS_PORT- );
  DFF inst379 (.CLRN(inst381_out), .CLK(SPI_RTC_CLK), .D(inst377_q), .PRN(1'b1), .Q(RTC_WRITE));
  not inst500 (\DFP_SOUND_PORT_DATA_IN- , DFP_SOUND_PORT_DATA_IN);
  not inst391 (\WIFI_PORT_DATA_OUT- , WIFI_PORT_DATA_OUT);
  or inst126 (\BI_INPUT_ENABLE- , \LOCAL_S100_INPUT- , \FPGA_8255_SELECT- );
  nor inst287 (RS232_PORT_DATA_OUT, \LOCAL_S100_OUTPUT- , \RS232_PORT_DATA- );
  DLATCH inst158[7:0] (
    .CLRN(\FPGA_BOARD_RESET- ), .D(Z80_LOCAL_DO), .ENA(MONITOR_DATA_OUT), .PRN(1'b1), .Q(MONITOR_DATA_OUT_BUS));
  \74244  inst262 (
    .\1A2 (inst84_q2), .\1A4 (inst84_q4), .\1A1 (inst84_q1), .\1A3 (inst84_q3), .\1GN (\FPGA_ACK- ),
    .\2A3 (inst84_q7), .\2GN (\FPGA_ACK- ), .\2A1 (inst84_q5), .\2A4 (inst84_q8), .\2A2 (inst84_q6),
    .\1Y2 (Z80_LOCAL_DI[1]), .\1Y4 (Z80_LOCAL_DI[3]), .\2Y1 (Z80_LOCAL_DI[4]), .\1Y1 (Z80_LOCAL_DI[0]),
    .\2Y3 (Z80_LOCAL_DI[6]), .\2Y4 (Z80_LOCAL_DI[7]), .\1Y3 (Z80_LOCAL_DI[2]), .\2Y2 (Z80_LOCAL_DI[5]));
  nand inst268 (inst268_out, Z80_INPUT, inst180_out);
  \74244  inst335 (
    .\1A2 (FPGA_IN_PRN_BUSY), .\1A4 (1'b1), .\1A1 (\LED_PRN_ACK- ), .\1A3 (1'b1), .\1GN (inst19_out),
    .\2A3 (1'b1), .\2GN (inst19_out), .\2A1 (1'b1), .\2A4 (1'b1), .\2A2 (1'b1), .\1Y2 (Z80_LOCAL_DI[1]),
    .\1Y4 (Z80_LOCAL_DI[3]), .\2Y1 (Z80_LOCAL_DI[4]), .\1Y1 (Z80_LOCAL_DI[0]), .\2Y3 (Z80_LOCAL_DI[6]),
    .\2Y4 (Z80_LOCAL_DI[7]), .\1Y3 (Z80_LOCAL_DI[2]), .\2Y2 (Z80_LOCAL_DI[5]));
  not inst518 (\USB_PORT_DATA_OUT- , USB_PORT_DATA_OUT);
  nor inst321 (FX_SOUND_PORT_STATUS_IN, \LOCAL_S100_INPUT- , \FX_SOUND_PORT_STATUS- );
  TRI inst322[7:0] (
    .IN(inst317_q), .OE(FX_SOUND_PORT_DATA_IN),
    .OUT({S100_DI7, S100_DI6, S100_DI5, S100_DI4, S100_DI3, S100_DI2, S100_DI1, S100_DI0}));
  \74244  inst256 (
    .\1A2 (inst226_q), .\1A4 (inst236_q), .\1A1 (inst225_q), .\1A3 (inst232_q), .\1GN (inst246_out),
    .\2A3 (inst244_q), .\2GN (inst246_out), .\2A1 (inst240_q), .\2A4 (inst245_q), .\2A2 (inst242_q),
    .\1Y2 (Z80_LOCAL_DI[6]), .\1Y4 (Z80_LOCAL_DI[4]), .\2Y1 (Z80_LOCAL_DI[3]), .\1Y1 (Z80_LOCAL_DI[7]),
    .\2Y3 (Z80_LOCAL_DI[1]), .\2Y4 (Z80_LOCAL_DI[0]), .\1Y3 (Z80_LOCAL_DI[5]), .\2Y2 (Z80_LOCAL_DI[2]));
  DLATCH inst479[7:0] (
    .CLRN(\FPGA_BOARD_RESET- ),
    .D({S100_DO7, S100_DO6, S100_DO5, S100_DO4, S100_DO3, S100_DO2, S100_DO1, S100_DO0}),
    .ENA(DFP_SOUND_PORT_DATA_OUT), .PRN(1'b1), .Q(DFP_SOUND_PORT_DATA_OUT_BUS));
  DLATCH inst481[7:0] (
    .CLRN(\FPGA_BOARD_RESET- ), .D(DFP_SOUND_PORT_DATA_IN_BUS), .ENA(DFP_SOUND_PORT_DATA_IN), .PRN(1'b1),
    .Q(inst481_q));
  not inst384 (\WIFI_PORT_DATA_IN- , WIFI_PORT_DATA_IN);
  not inst399 (\RS232_PORT_DATA_OUT- , RS232_PORT_DATA_OUT);
  and inst55 (Z80_OUTPUT, Z80_WR, Z80_IORQ);
  and inst56 (Z80_INPUT, Z80_IORQ, Z80_RD);
  and inst57 (MEM_READ, Z80_RD, Z80_MREQ);
  not inst372 (\LED_PRN_BUSY- , FPGA_IN_PRN_BUSY);
  not inst517 (\USB_PORT_DATA_IN- , USB_PORT_DATA_IN);
  nor inst483 (DFP_SOUND_PORT_STATUS_IN, \LOCAL_S100_INPUT- , \DFP_SOUND_PORT_STATUS- );
  TRI inst484[7:0] (
    .IN(inst481_q), .OE(DFP_SOUND_PORT_DATA_IN),
    .OUT({S100_DI7, S100_DI6, S100_DI5, S100_DI4, S100_DI3, S100_DI2, S100_DI1, S100_DI0}));
  DFF inst95 (.CLRN(1'b1), .CLK(LOCAL_CPU_CLK), .D(1'b1), .PRN(\FPGA_BOARD_RESET- ), .Q(inst95_q));
  \74244  inst264 (
    .\1A2 (1'b0), .\1A4 (1'b0), .\1A1 (FPGA_RTS), .\1A3 (1'b0), .\1GN (inst268_out), .\2A3 (inst326_1q),
    .\2GN (inst268_out), .\2A1 (1'b0), .\2A4 (S100_RTS), .\2A2 (1'b0), .\1Y2 (Z80_LOCAL_DI[1]),
    .\1Y4 (Z80_LOCAL_DI[3]), .\2Y1 (Z80_LOCAL_DI[4]), .\1Y1 (Z80_LOCAL_DI[0]), .\2Y3 (Z80_LOCAL_DI[6]),
    .\2Y4 (Z80_LOCAL_DI[7]), .\1Y3 (Z80_LOCAL_DI[2]), .\2Y2 (Z80_LOCAL_DI[5]));
  DLATCH inst360 (.CLRN(\FPGA_BOARD_RESET- ), .D(PS2_KEYBOARD_STATUS), .ENA(PS2_STATUS_IN), .PRN(1'b1), .Q(inst360_q));
  not inst516 (inst516_out, S100_sINP);
  DLATCH inst183[7:0] (
    .CLRN(\FPGA_BOARD_RESET- ),
    .D({S100_DO7, S100_DO6, S100_DO5, S100_DO4, S100_DO3, S100_DO2, S100_DO1, S100_DO0}),
    .ENA(USB_PORT_DATA_OUT), .PRN(1'b1), .Q(USB_PORT_DATA_OUT_BUS));
  DLATCH inst223[7:0] (
    .CLRN(\FPGA_BOARD_RESET- ),
    .D({S100_DO7, S100_DO6, S100_DO5, S100_DO4, S100_DO3, S100_DO2, S100_DO1, S100_DO0}),
    .ENA(WIFI_PORT_DATA_OUT), .PRN(1'b1), .Q(WIFI_PORT_DATA_OUT_BUS));
  DLATCH inst228[7:0] (
    .CLRN(\FPGA_BOARD_RESET- ), .D(WIFI_PORT_DATA_IN_BUS), .ENA(WIFI_PORT_DATA_IN), .PRN(1'b1), .Q(inst228_q));
  not inst392 (\RS232_PORT_DATA_IN- , RS232_PORT_DATA_IN);
  not inst34 (\Z80_OUTPUT- , Z80_OUTPUT);
  and inst63 (MEM_WRITE, Z80_WR, Z80_MREQ);
  \74244  inst263 (
    .\1A2 (inst235_1q), .\1A4 (1'b0), .\1A1 (FPGA_RTS), .\1A3 (inst235_2q), .\1GN (inst108_out),
    .\2A3 (1'b0), .\2GN (inst108_out), .\2A1 (1'b0), .\2A4 (S100_RTS), .\2A2 (1'b0), .\1Y2 (S100_DI1),
    .\1Y4 (S100_DI3), .\2Y1 (S100_DI4), .\1Y1 (S100_DI0), .\2Y3 (S100_DI6), .\2Y4 (S100_DI7),
    .\1Y3 (S100_DI2), .\2Y2 (S100_DI5));
  not inst390 (inst390_out, RTC_BUSY_FLAG);
  DLATCH inst185[7:0] (
    .CLRN(\FPGA_BOARD_RESET- ), .D(USB_PORT_DATA_IN_BUS), .ENA(USB_PORT_DATA_IN), .PRN(1'b1), .Q(inst185_q));
  nor inst243 (WIFI_PORT_STATUS_IN, \LOCAL_S100_INPUT- , \WIFI_PORT_STATUS- );
  DLATCH inst289[7:0] (
    .CLRN(\FPGA_BOARD_RESET- ),
    .D({S100_DO7, S100_DO6, S100_DO5, S100_DO4, S100_DO3, S100_DO2, S100_DO1, S100_DO0}),
    .ENA(RS232_PORT_DATA_OUT), .PRN(1'b1), .Q(RS232_PORT_DATA_OUT_BUS));
  not inst52 (\Z80_INPUT- , Z80_INPUT);
  nor inst382 (inst382_out, \Z80_INPUT- , \RTC_RW- );
  nor inst65 (inst65_out, \Z80_OUTPUT- , \RTC_DATA- );
  nor inst208 (USB_PORT_STATUS_IN, inst516_out, \USB_PORT_STATUS- );
  TRI inst186[7:0] (
    .IN(inst185_q), .OE(USB_PORT_DATA_IN),
    .OUT({S100_DI7, S100_DI6, S100_DI5, S100_DI4, S100_DI3, S100_DI2, S100_DI1, S100_DI0}));
  not inst337 (\FX_SOUND_PORT_STATUS_IN- , FX_SOUND_PORT_STATUS_IN);
  TRI inst252[7:0] (
    .IN(inst228_q), .OE(WIFI_PORT_DATA_IN),
    .OUT({S100_DI7, S100_DI6, S100_DI5, S100_DI4, S100_DI3, S100_DI2, S100_DI1, S100_DI0}));
  DLATCH inst291[7:0] (
    .CLRN(\FPGA_BOARD_RESET- ), .D(RS232_PORT_DATA_IN_BUS), .ENA(RS232_PORT_DATA_IN), .PRN(1'b1),
    .Q(inst291_q));
  and inst436 (inst436_out, inst390_out, \FPGA_BOARD_RESET- );
  TRI inst172 (.IN(inst360_q), .OE(PS2_STATUS_IN), .OUT(S100_DI0));
  nor inst293 (RS232_PORT_STATUS_IN, \LOCAL_S100_INPUT- , \RS232_PORT_STATUS- );
  and inst348 (\F_BOARD_ACTIVE- , inst95_q, CPU_CLK_COUNTER[22]);
  nor inst224 (MONITOR_ZCO_OVERIDE, \Z80_OUTPUT- , \MONITOR_STATUS- );
  DFF inst387 (.CLRN(inst436_out), .CLK(inst382_out), .D(1'b1), .PRN(1'b1), .Q(inst387_q));
  TRI inst297[7:0] (
    .IN(inst291_q), .OE(RS232_PORT_DATA_IN),
    .OUT({S100_DI7, S100_DI6, S100_DI5, S100_DI4, S100_DI3, S100_DI2, S100_DI1, S100_DI0}));
  DLATCH inst324 (
    .CLRN(\FPGA_BOARD_RESET- ), .D(FX_SOUND_PORT_DATA_READY), .ENA(FX_SOUND_PORT_STATUS_IN), .PRN(1'b1),
    .Q(inst324_q));
  DLATCH inst327 (
    .CLRN(\FPGA_BOARD_RESET- ), .D(FX_SOUND_PORT_Busy), .ENA(FX_SOUND_PORT_STATUS_IN), .PRN(1'b1),
    .Q(inst327_q));
  DLATCH inst328 (
    .CLRN(\FPGA_BOARD_RESET- ), .D(FX_SOUND_PORT_Byte_Recieved), .ENA(FX_SOUND_PORT_STATUS_IN), .PRN(1'b1),
    .Q(inst328_q));
  DLATCH inst329 (.CLRN(\FPGA_BOARD_RESET- ), .D(1'b0), .ENA(FX_SOUND_PORT_STATUS_IN), .PRN(1'b1), .Q(inst329_q));
  DLATCH inst330 (.CLRN(\FPGA_BOARD_RESET- ), .D(1'b0), .ENA(FX_SOUND_PORT_STATUS_IN), .PRN(1'b1), .Q(inst330_q));
  DLATCH inst331 (.CLRN(\FPGA_BOARD_RESET- ), .D(1'b0), .ENA(FX_SOUND_PORT_STATUS_IN), .PRN(1'b1), .Q(inst331_q));
  DLATCH inst332 (.CLRN(\FPGA_BOARD_RESET- ), .D(1'b1), .ENA(FX_SOUND_PORT_STATUS_IN), .PRN(1'b1), .Q(inst332_q));
  DLATCH inst333 (
    .CLRN(\FPGA_BOARD_RESET- ), .D(FX_SOUND_PORT_Error), .ENA(FX_SOUND_PORT_STATUS_IN), .PRN(1'b1),
    .Q(inst333_q));
  not inst495 (\DFP_SOUND_PORT_STATUS_IN- , DFP_SOUND_PORT_STATUS_IN);
  not inst280 (\WIFI_PORT_STATUS_IN- , WIFI_PORT_STATUS_IN);
  DLATCH inst258 (.D(Z80_LOCAL_DO[0]), .ENA(MONITOR_ZCO_OVERIDE), .Q(MONITOR_OVERIDE));  // open: CLRN, PRN
  nor inst303 (inst303_out, \Z80_OUTPUT- , \LEDS_PORT- );
  DFF inst389 (.CLRN(inst436_out), .CLK(SPI_RTC_CLK), .D(inst387_q), .PRN(1'b1), .Q(RTC_READ));
  DLATCH inst439 (.CLRN(\FPGA_BOARD_RESET- ), .D(Z80_LOCAL_DO[0]), .ENA(inst65_out), .PRN(1'b1), .Q(RTC_DATA_OUT[8]));
  DLATCH inst440 (.CLRN(\FPGA_BOARD_RESET- ), .D(Z80_LOCAL_DO[1]), .ENA(inst65_out), .PRN(1'b1), .Q(RTC_DATA_OUT[9]));
  DLATCH inst441 (.CLRN(\FPGA_BOARD_RESET- ), .D(Z80_LOCAL_DO[2]), .ENA(inst65_out), .PRN(1'b1), .Q(RTC_DATA_OUT[10]));
  DLATCH inst442 (.CLRN(\FPGA_BOARD_RESET- ), .D(Z80_LOCAL_DO[3]), .ENA(inst65_out), .PRN(1'b1), .Q(RTC_DATA_OUT[11]));
  DLATCH inst443 (.CLRN(\FPGA_BOARD_RESET- ), .D(Z80_LOCAL_DO[4]), .ENA(inst65_out), .PRN(1'b1), .Q(RTC_DATA_OUT[12]));
  DLATCH inst444 (.CLRN(\FPGA_BOARD_RESET- ), .D(Z80_LOCAL_DO[5]), .ENA(inst65_out), .PRN(1'b1), .Q(RTC_DATA_OUT[13]));
  DLATCH inst445 (.CLRN(\FPGA_BOARD_RESET- ), .D(Z80_LOCAL_DO[6]), .ENA(inst65_out), .PRN(1'b1), .Q(RTC_DATA_OUT[14]));
  DLATCH inst446 (.CLRN(\FPGA_BOARD_RESET- ), .D(Z80_LOCAL_DO[7]), .ENA(inst65_out), .PRN(1'b1), .Q(RTC_DATA_OUT[15]));
  not inst219 (\USB_PORT_STATUS_IN- , USB_PORT_STATUS_IN);
  DLATCH inst486 (
    .CLRN(\FPGA_BOARD_RESET- ), .D(DFP_SOUND_PORT_DATA_READY), .ENA(DFP_SOUND_PORT_STATUS_IN), .PRN(1'b1),
    .Q(inst486_q));
  DLATCH inst487 (
    .CLRN(\FPGA_BOARD_RESET- ), .D(DFP_SOUND_PORT_Busy), .ENA(DFP_SOUND_PORT_STATUS_IN), .PRN(1'b1),
    .Q(inst487_q));
  DLATCH inst488 (
    .CLRN(\FPGA_BOARD_RESET- ), .D(DFP_SOUND_PORT_Byte_Recieved), .ENA(DFP_SOUND_PORT_STATUS_IN), .PRN(1'b1),
    .Q(inst488_q));
  DLATCH inst489 (.CLRN(\FPGA_BOARD_RESET- ), .D(DFP_BUSY), .ENA(DFP_SOUND_PORT_STATUS_IN), .PRN(1'b1), .Q(inst489_q));
  DLATCH inst490 (.CLRN(\FPGA_BOARD_RESET- ), .D(1'b0), .ENA(DFP_SOUND_PORT_STATUS_IN), .PRN(1'b1), .Q(inst490_q));
  DLATCH inst491 (.CLRN(\FPGA_BOARD_RESET- ), .D(1'b0), .ENA(DFP_SOUND_PORT_STATUS_IN), .PRN(1'b1), .Q(inst491_q));
  DLATCH inst492 (.CLRN(\FPGA_BOARD_RESET- ), .D(1'b0), .ENA(DFP_SOUND_PORT_STATUS_IN), .PRN(1'b1), .Q(inst492_q));
  DLATCH inst493 (
    .CLRN(\FPGA_BOARD_RESET- ), .D(DFP_SOUND_PORT_Error), .ENA(DFP_SOUND_PORT_STATUS_IN), .PRN(1'b1),
    .Q(inst493_q));
  not inst241 (BOARD_RESET, \FPGA_BOARD_RESET- );
  nor inst205 (MONITOR_STATUS_IN, \Z80_INPUT- , \MONITOR_STATUS- );
  not inst309 (\RS232_PORT_STATUS_IN- , RS232_PORT_STATUS_IN);
  DLATCH inst254 (
    .CLRN(\FPGA_BOARD_RESET- ), .D(WIFI_DATA_READY), .ENA(WIFI_PORT_STATUS_IN), .PRN(1'b1), .Q(inst254_q));
  DLATCH inst269 (.CLRN(\FPGA_BOARD_RESET- ), .D(WIFI_Busy), .ENA(WIFI_PORT_STATUS_IN), .PRN(1'b1), .Q(inst269_q));
  DLATCH inst270 (
    .CLRN(\FPGA_BOARD_RESET- ), .D(WIFI_Byte_Recieved), .ENA(WIFI_PORT_STATUS_IN), .PRN(1'b1), .Q(inst270_q));
  DLATCH inst271 (.CLRN(\FPGA_BOARD_RESET- ), .D(1'b0), .ENA(WIFI_PORT_STATUS_IN), .PRN(1'b1), .Q(inst271_q));
  DLATCH inst272 (.CLRN(\FPGA_BOARD_RESET- ), .D(1'b0), .ENA(WIFI_PORT_STATUS_IN), .PRN(1'b1), .Q(inst272_q));
  DLATCH inst273 (.CLRN(\FPGA_BOARD_RESET- ), .D(1'b0), .ENA(WIFI_PORT_STATUS_IN), .PRN(1'b1), .Q(inst273_q));
  DLATCH inst274 (.CLRN(\FPGA_BOARD_RESET- ), .D(1'b0), .ENA(WIFI_PORT_STATUS_IN), .PRN(1'b1), .Q(inst274_q));
  DLATCH inst275 (.CLRN(\FPGA_BOARD_RESET- ), .D(WIFI_Error), .ENA(WIFI_PORT_STATUS_IN), .PRN(1'b1), .Q(inst275_q));
  DLATCH inst209 (
    .CLRN(\FPGA_BOARD_RESET- ), .D(USB_PORT_DATA_READY), .ENA(USB_PORT_STATUS_IN), .PRN(1'b1), .Q(inst209_q));
  DLATCH inst211 (.CLRN(\FPGA_BOARD_RESET- ), .D(USB_PORT_CTS), .ENA(USB_PORT_STATUS_IN), .PRN(1'b1), .Q(inst211_q));
  DLATCH inst212 (
    .CLRN(\FPGA_BOARD_RESET- ), .D(USB_PORT_Byte_Recieved), .ENA(USB_PORT_STATUS_IN), .PRN(1'b1),
    .Q(inst212_q));
  DLATCH inst214 (.CLRN(\FPGA_BOARD_RESET- ), .D(1'b0), .ENA(USB_PORT_STATUS_IN), .PRN(1'b1), .Q(inst214_q));
  DLATCH inst215 (.CLRN(\FPGA_BOARD_RESET- ), .D(1'b0), .ENA(USB_PORT_STATUS_IN), .PRN(1'b1), .Q(inst215_q));
  DLATCH inst216 (.CLRN(\FPGA_BOARD_RESET- ), .D(1'b0), .ENA(USB_PORT_STATUS_IN), .PRN(1'b1), .Q(inst216_q));
  DLATCH inst217 (.CLRN(\FPGA_BOARD_RESET- ), .D(1'b0), .ENA(USB_PORT_STATUS_IN), .PRN(1'b1), .Q(inst217_q));
  DLATCH inst218 (.CLRN(\FPGA_BOARD_RESET- ), .D(USB_PORT_Error), .ENA(USB_PORT_STATUS_IN), .PRN(1'b1), .Q(inst218_q));
  DLATCH inst299 (
    .CLRN(\FPGA_BOARD_RESET- ), .D(RS232_PORT_DATA_READY), .ENA(RS232_PORT_STATUS_IN), .PRN(1'b1),
    .Q(inst299_q));
  DLATCH inst300 (
    .CLRN(\FPGA_BOARD_RESET- ), .D(\FPGA_SERIAL_CTS- ), .ENA(RS232_PORT_STATUS_IN), .PRN(1'b1), .Q(inst300_q));
  DLATCH inst301 (
    .CLRN(\FPGA_BOARD_RESET- ), .D(RS232_Byte_Recieved), .ENA(RS232_PORT_STATUS_IN), .PRN(1'b1), .Q(inst301_q));
  DLATCH inst302 (
    .CLRN(\FPGA_BOARD_RESET- ), .D(\FPGA_SERIAL_DTR- ), .ENA(RS232_PORT_STATUS_IN), .PRN(1'b1), .Q(inst302_q));
  DLATCH inst304 (.CLRN(\FPGA_BOARD_RESET- ), .D(1'b0), .ENA(RS232_PORT_STATUS_IN), .PRN(1'b1), .Q(inst304_q));
  DLATCH inst305 (.CLRN(\FPGA_BOARD_RESET- ), .D(1'b0), .ENA(RS232_PORT_STATUS_IN), .PRN(1'b1), .Q(inst305_q));
  DLATCH inst306 (.CLRN(\FPGA_BOARD_RESET- ), .D(1'b0), .ENA(RS232_PORT_STATUS_IN), .PRN(1'b1), .Q(inst306_q));
  DLATCH inst307 (
    .CLRN(\FPGA_BOARD_RESET- ), .D(RS232_PORT_Error), .ENA(RS232_PORT_STATUS_IN), .PRN(1'b1), .Q(inst307_q));
  not inst206 (\MONITOR_STATUS_IN- , MONITOR_STATUS_IN);
  \74244  inst336 (
    .\1A2 (inst327_q), .\1A4 (inst329_q), .\1A1 (inst324_q), .\1A3 (inst328_q),
    .\1GN (\FX_SOUND_PORT_STATUS_IN- ), .\2A3 (inst332_q), .\2GN (\FX_SOUND_PORT_STATUS_IN- ),
    .\2A1 (inst330_q), .\2A4 (inst333_q), .\2A2 (inst331_q), .\1Y2 (S100_DI1), .\1Y4 (S100_DI3),
    .\2Y1 (S100_DI4), .\1Y1 (S100_DI0), .\2Y3 (S100_DI6), .\2Y4 (S100_DI7), .\1Y3 (S100_DI2), .\2Y2 (S100_DI5));
  DLATCH inst531 (.CLRN(\FPGA_BOARD_RESET- ), .D(Z80_LOCAL_DO[0]), .ENA(inst303_out), .PRN(1'b1), .Q(inst531_q));
  DLATCH inst532 (.CLRN(\FPGA_BOARD_RESET- ), .D(Z80_LOCAL_DO[1]), .ENA(inst303_out), .PRN(1'b1), .Q(inst532_q));
  DLATCH inst533 (.CLRN(\FPGA_BOARD_RESET- ), .D(Z80_LOCAL_DO[2]), .ENA(inst303_out), .PRN(1'b1), .Q(inst533_q));
  DLATCH inst539 (.CLRN(\FPGA_BOARD_RESET- ), .D(Z80_LOCAL_DO[3]), .ENA(inst303_out), .PRN(1'b1), .Q(inst539_q));
  DLATCH inst541 (.CLRN(\FPGA_BOARD_RESET- ), .D(Z80_LOCAL_DO[4]), .ENA(inst303_out), .PRN(1'b1), .Q(inst541_q));
  DLATCH inst542 (.CLRN(\FPGA_BOARD_RESET- ), .D(Z80_LOCAL_DO[5]), .ENA(inst303_out), .PRN(1'b1), .Q(inst542_q));
  DLATCH inst543 (.CLRN(\FPGA_BOARD_RESET- ), .D(Z80_LOCAL_DO[6]), .ENA(inst303_out), .PRN(1'b1), .Q(inst543_q));
  DLATCH inst544 (.CLRN(\FPGA_BOARD_RESET- ), .D(Z80_LOCAL_DO[7]), .ENA(inst303_out), .PRN(1'b1), .Q(inst544_q));
  \74244  inst494 (
    .\1A2 (inst487_q), .\1A4 (inst489_q), .\1A1 (inst486_q), .\1A3 (inst488_q),
    .\1GN (\DFP_SOUND_PORT_STATUS_IN- ), .\2A3 (inst492_q), .\2GN (\DFP_SOUND_PORT_STATUS_IN- ),
    .\2A1 (inst490_q), .\2A4 (inst493_q), .\2A2 (inst491_q), .\1Y2 (S100_DI1), .\1Y4 (S100_DI3),
    .\2Y1 (S100_DI4), .\1Y1 (S100_DI0), .\2Y3 (S100_DI6), .\2Y4 (S100_DI7), .\1Y3 (S100_DI2), .\2Y2 (S100_DI5));
  DLATCH inst194 (
    .CLRN(\FPGA_BOARD_RESET- ), .D(MONITOR_DATA_READY), .ENA(MONITOR_STATUS_IN), .PRN(1'b1), .Q(inst194_q));
  DLATCH inst195 (.CLRN(\FPGA_BOARD_RESET- ), .D(MONITOR_CTS), .ENA(MONITOR_STATUS_IN), .PRN(1'b1), .Q(inst195_q));
  DLATCH inst196 (
    .CLRN(\FPGA_BOARD_RESET- ), .D(MONITOR_Byte_Recieved), .ENA(MONITOR_STATUS_IN), .PRN(1'b1), .Q(inst196_q));
